# EAGLE design main (EAGLE 7.7.0)

## Sheet 1 of 7
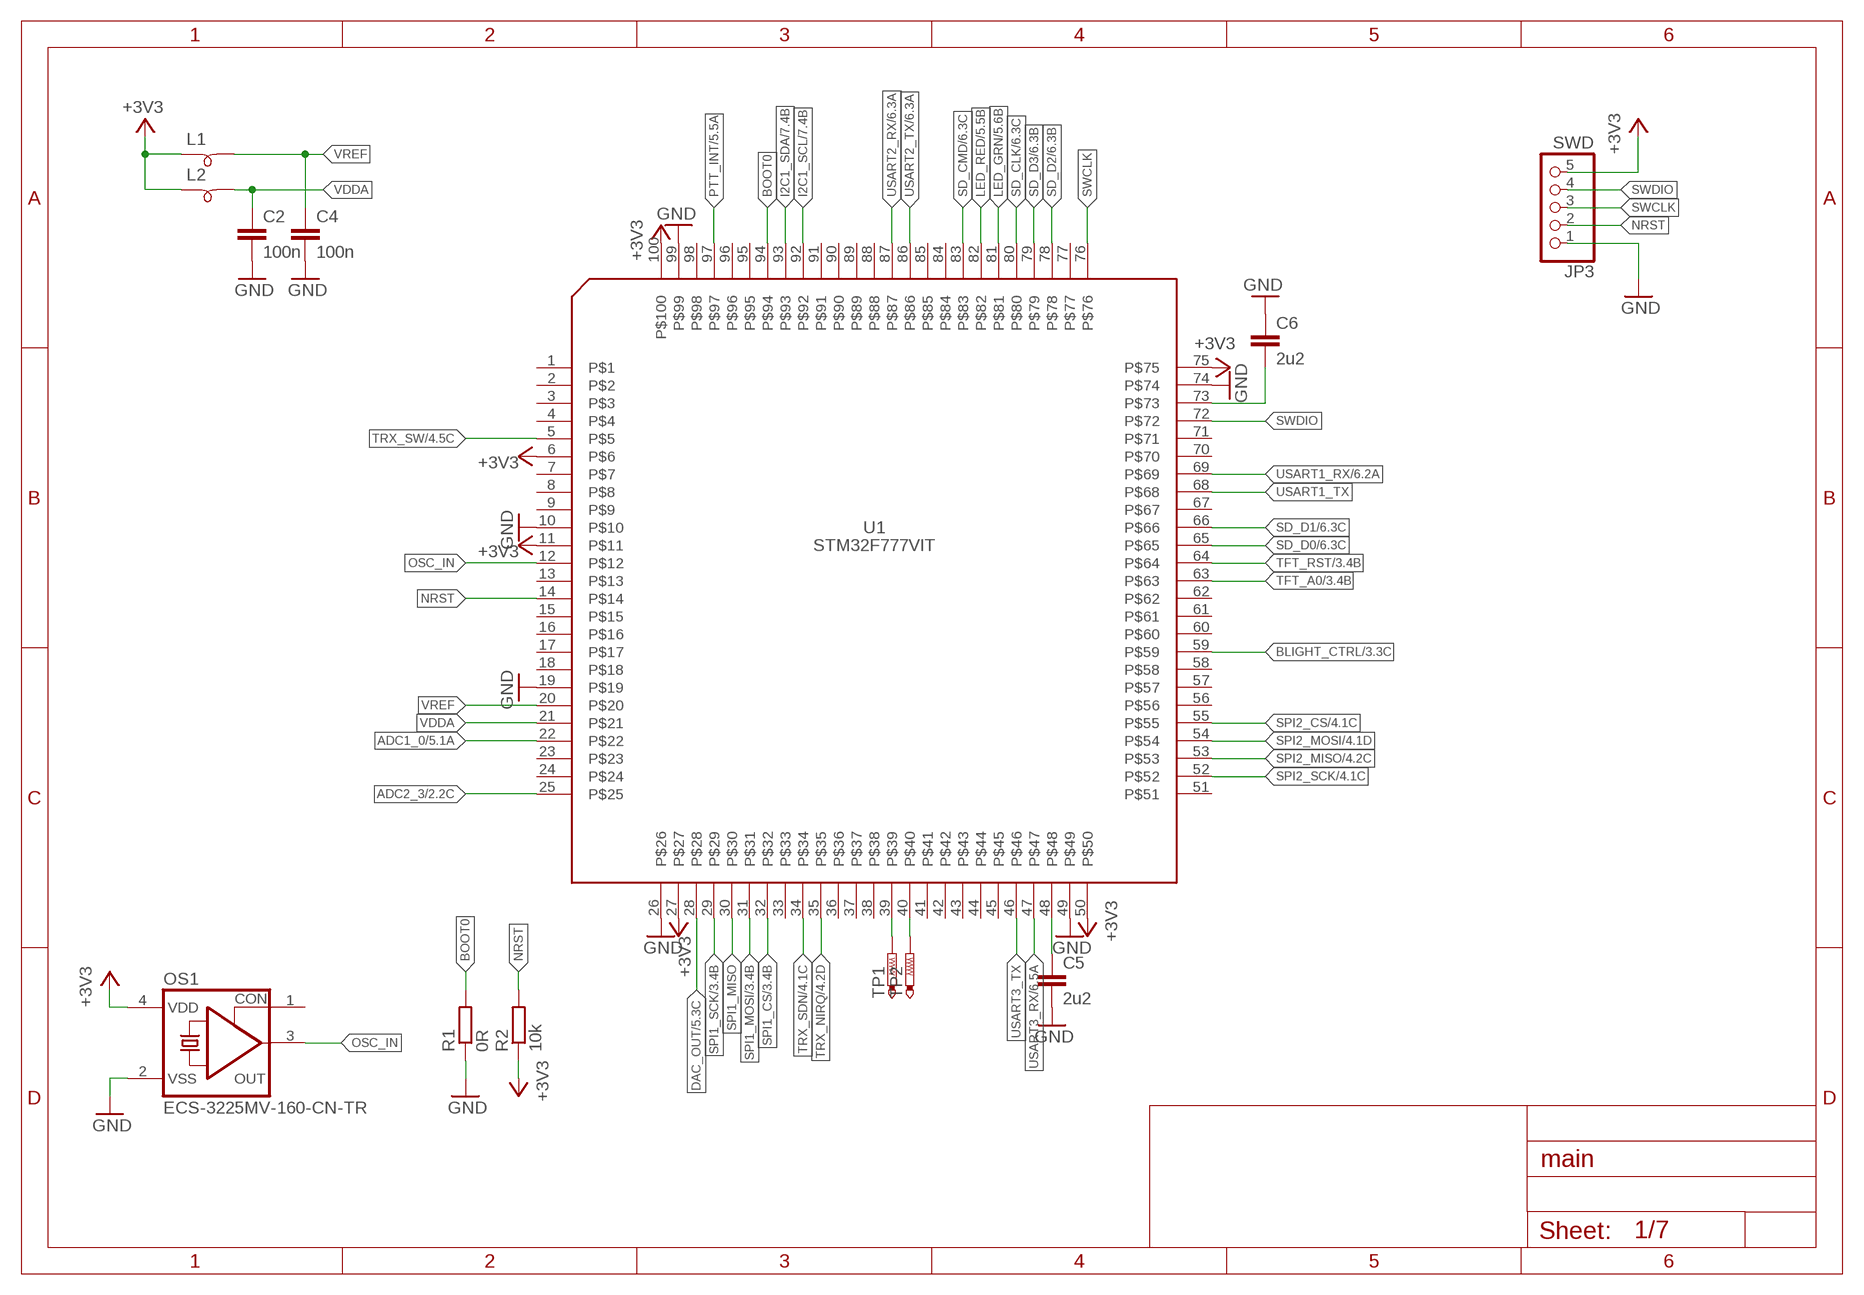
[diagram p0: schematic, sheet 1]

### Parts
C2  100n  C-EUC0805  [C0805]
C4  100n  C-EUC0805  [C0805]
C5  2u2  C-EUC1206  [C1206]
C6  2u2  C-EUC1206  [C1206]
JP3  SWD  PINHD-1X5/90  [1X05/90]
L1  SM-B5  [SM-B5]
L2  SM-B5  [SM-B5]
OS1  ECS-3225MV-160-CN-TR  OSC-OE-CFPS-39  [3.4X2.7-4-PAD]
R1  0R  R-EU_R0805  [R0805]
R2  10k  R-EU_R0805  [R0805]
TP1  PTR1B1,27  [B1,27]
TP2  PTR1B1,27  [B1,27]
U1  STM32F777VIT  [LQFP100]

### Nets
+3V3 [pwr]: JP3.5 L1.1 L2.1 OS1.4(VDD) R2.1 U1.6 U1.11 U1.27 U1.50 U1.75 U1.100 ; also sheet 2,3,4,5,6,7
ADC1_0: U1.22 ; also sheet 5
ADC2_3: U1.25 ; also sheet 2
BLIGHT_CTRL: U1.59 ; also sheet 3
BOOT0: R1.2 U1.94
DAC_OUT: U1.28 ; also sheet 5
GND [pwr]: C2.2 C4.2 C5.2 C6.1 JP3.1 OS1.2(VSS) R1.1 U1.10 U1.19 U1.26 U1.49 U1.74 U1.99 ; also sheet 2,3,4,5,6,7
I2C1_SCL: U1.92 ; also sheet 7
I2C1_SDA: U1.93 ; also sheet 7
LED_GRN: U1.81 ; also sheet 5
LED_RED: U1.82 ; also sheet 5
N$1: C6.2 U1.73
N$6: C5.1 U1.48
N$19: TP1.TP U1.39
N$20: TP2.TP U1.40
NRST: JP3.2 R2.2 U1.14
OSC_IN: OS1.3(OUT) U1.12
PTT_INT: U1.97 ; also sheet 5
SD_CLK: U1.80 ; also sheet 6
SD_CMD: U1.83 ; also sheet 6
SD_D0: U1.65 ; also sheet 6
SD_D1: U1.66 ; also sheet 6
SD_D2: U1.78 ; also sheet 6
SD_D3: U1.79 ; also sheet 6
SPI1_CS: U1.32 ; also sheet 3
SPI1_MISO: U1.30
SPI1_MOSI: U1.31 ; also sheet 3
SPI1_SCK: U1.29 ; also sheet 3
SPI2_CS: U1.55 ; also sheet 4
SPI2_MISO: U1.53 ; also sheet 4
SPI2_MOSI: U1.54 ; also sheet 4
SPI2_SCK: U1.52 ; also sheet 4
SWCLK: JP3.3 U1.76
SWDIO: JP3.4 U1.72
TFT_A0: U1.63 ; also sheet 3
TFT_RST: U1.64 ; also sheet 3
TRX_NIRQ: U1.35 ; also sheet 4
TRX_SDN: U1.34 ; also sheet 4
TRX_SW: U1.5 ; also sheet 4
USART1_RX: U1.69 ; also sheet 6
USART1_TX: U1.68
USART2_RX: U1.87 ; also sheet 6
USART2_TX: U1.86 ; also sheet 6
USART3_RX: U1.47 ; also sheet 6
USART3_TX: U1.46
VDDA: C2.1 L2.2 U1.21
VREF: C4.1 L1.2 U1.20
Unconnected: OS1.1(CON) U1.1 U1.2 U1.3 U1.4 U1.7 U1.8 U1.9 U1.13 U1.15 U1.16 U1.17 U1.18 U1.23 U1.24 U1.33 U1.36 U1.37 U1.38 U1.41 U1.42 U1.43 U1.44 U1.45 U1.51 U1.56 U1.57 U1.58 U1.60 U1.61 U1.62 U1.67 U1.70 U1.71 U1.77 U1.84 U1.85 U1.88 U1.89 U1.90 U1.91 U1.95 U1.96 U1.98

## Sheet 2 of 7
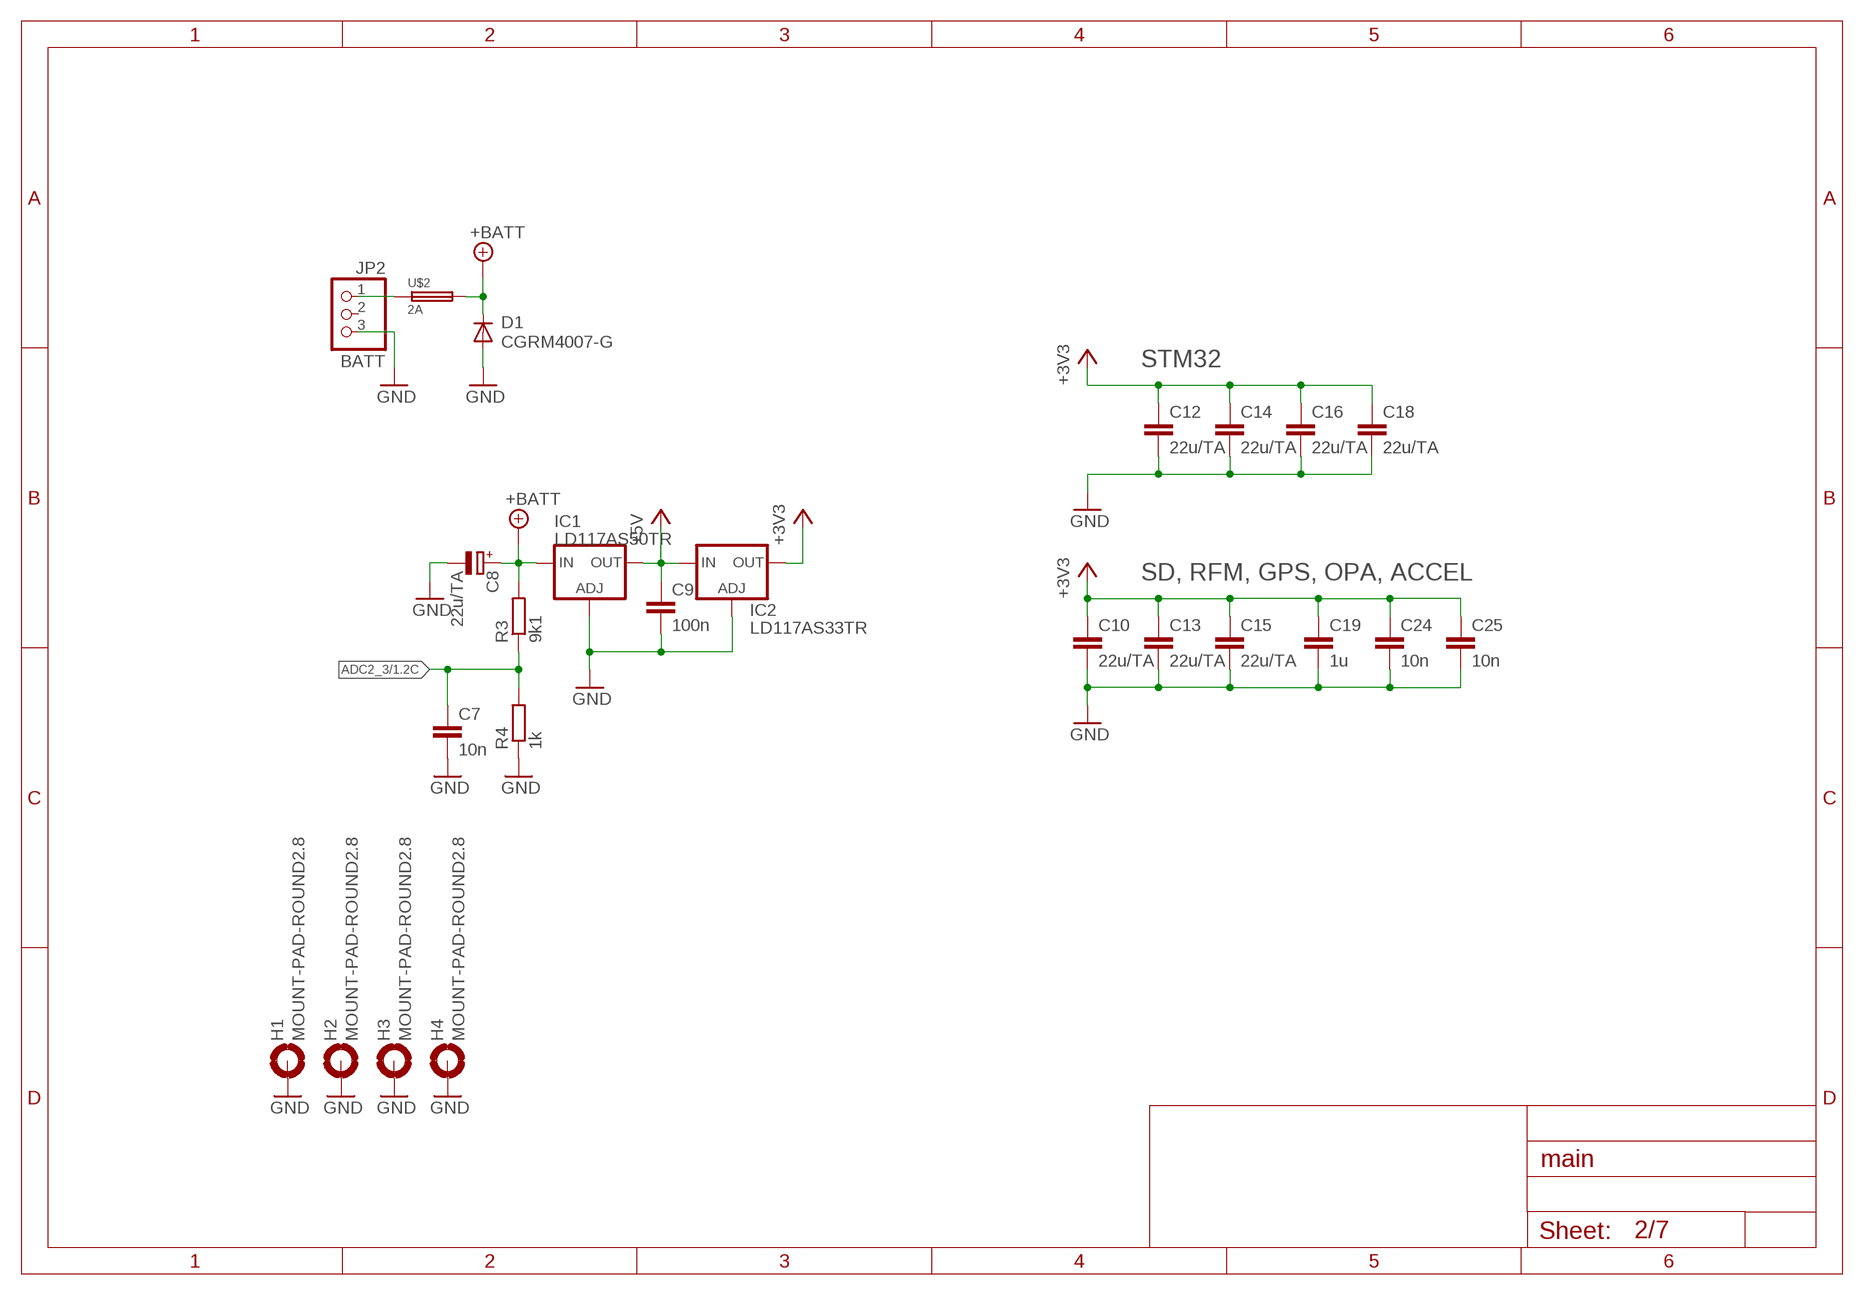
[diagram p1: schematic, sheet 2]

### Parts
C7  10n  C-EUC0805  [C0805]
C8  22u/TA  CPOL-EUSMCC  [SMC_C]
C9  100n  C-EUC1206  [C1206]
C10  22u/TA  C-EUC1206  [C1206]
C12  22u/TA  C-EUC1206  [C1206]
C13  22u/TA  C-EUC1206  [C1206]
C14  22u/TA  C-EUC1206  [C1206]
C15  22u/TA  C-EUC1206  [C1206]
C16  22u/TA  C-EUC1206  [C1206]
C18  22u/TA  C-EUC1206  [C1206]
C19  1u  C-EUC1206  [C1206]
C24  10n  C-EUC0805  [C0805]
C25  10n  C-EUC0805  [C0805]
D1  CGRM4007-G  [SOD-123_MINI-SMA]
H1  MOUNT-PAD-ROUND2.8  [2,8-PAD]
H2  MOUNT-PAD-ROUND2.8  [2,8-PAD]
H3  MOUNT-PAD-ROUND2.8  [2,8-PAD]
H4  MOUNT-PAD-ROUND2.8  [2,8-PAD]
IC1  LD117AS50TR  [SOT223]
IC2  LD117AS33TR  [SOT223]
JP2  BATT  PINHD-1X3/90  [1X03/90]
R3  9k1  R-EU_R0805  [R0805]
R4  1k  R-EU_R0805  [R0805]
U$2  2A  SMD-FUSE  [1206]

### Nets
+3V3 [pwr]: C10.1 C12.1 C13.1 C14.1 C15.1 C16.1 C18.1 C19.1 C24.1 C25.1 IC2.4(OUT) ; also sheet 1,3,4,5,6,7
+5V [pwr]: C9.1 IC1.4(OUT) IC2.3(IN)
+BATT [pwr]: C8.+ D1.C IC1.3(IN) R3.2 U$2.2 ; also sheet 4,5
ADC2_3: C7.1 R3.1 R4.2 ; also sheet 1
GND [pwr]: C7.2 C8.- C9.2 C10.2 C12.2 C13.2 C14.2 C15.2 C16.2 C18.2 C19.2 C24.2 C25.2 D1.A H1.B2,8(MOUNT) H2.B2,8(MOUNT) H3.B2,8(MOUNT) H4.B2,8(MOUNT) IC1.1(ADJ) IC2.1(ADJ) JP2.3 R4.1 ; also sheet 1,3,4,5,6,7
N$8 [pwr]: JP2.1 U$2.1
Unconnected: JP2.2

### Notes on the sheet
- STM32
- SD, RFM, GPS, OPA, ACCEL

## Sheet 3 of 7
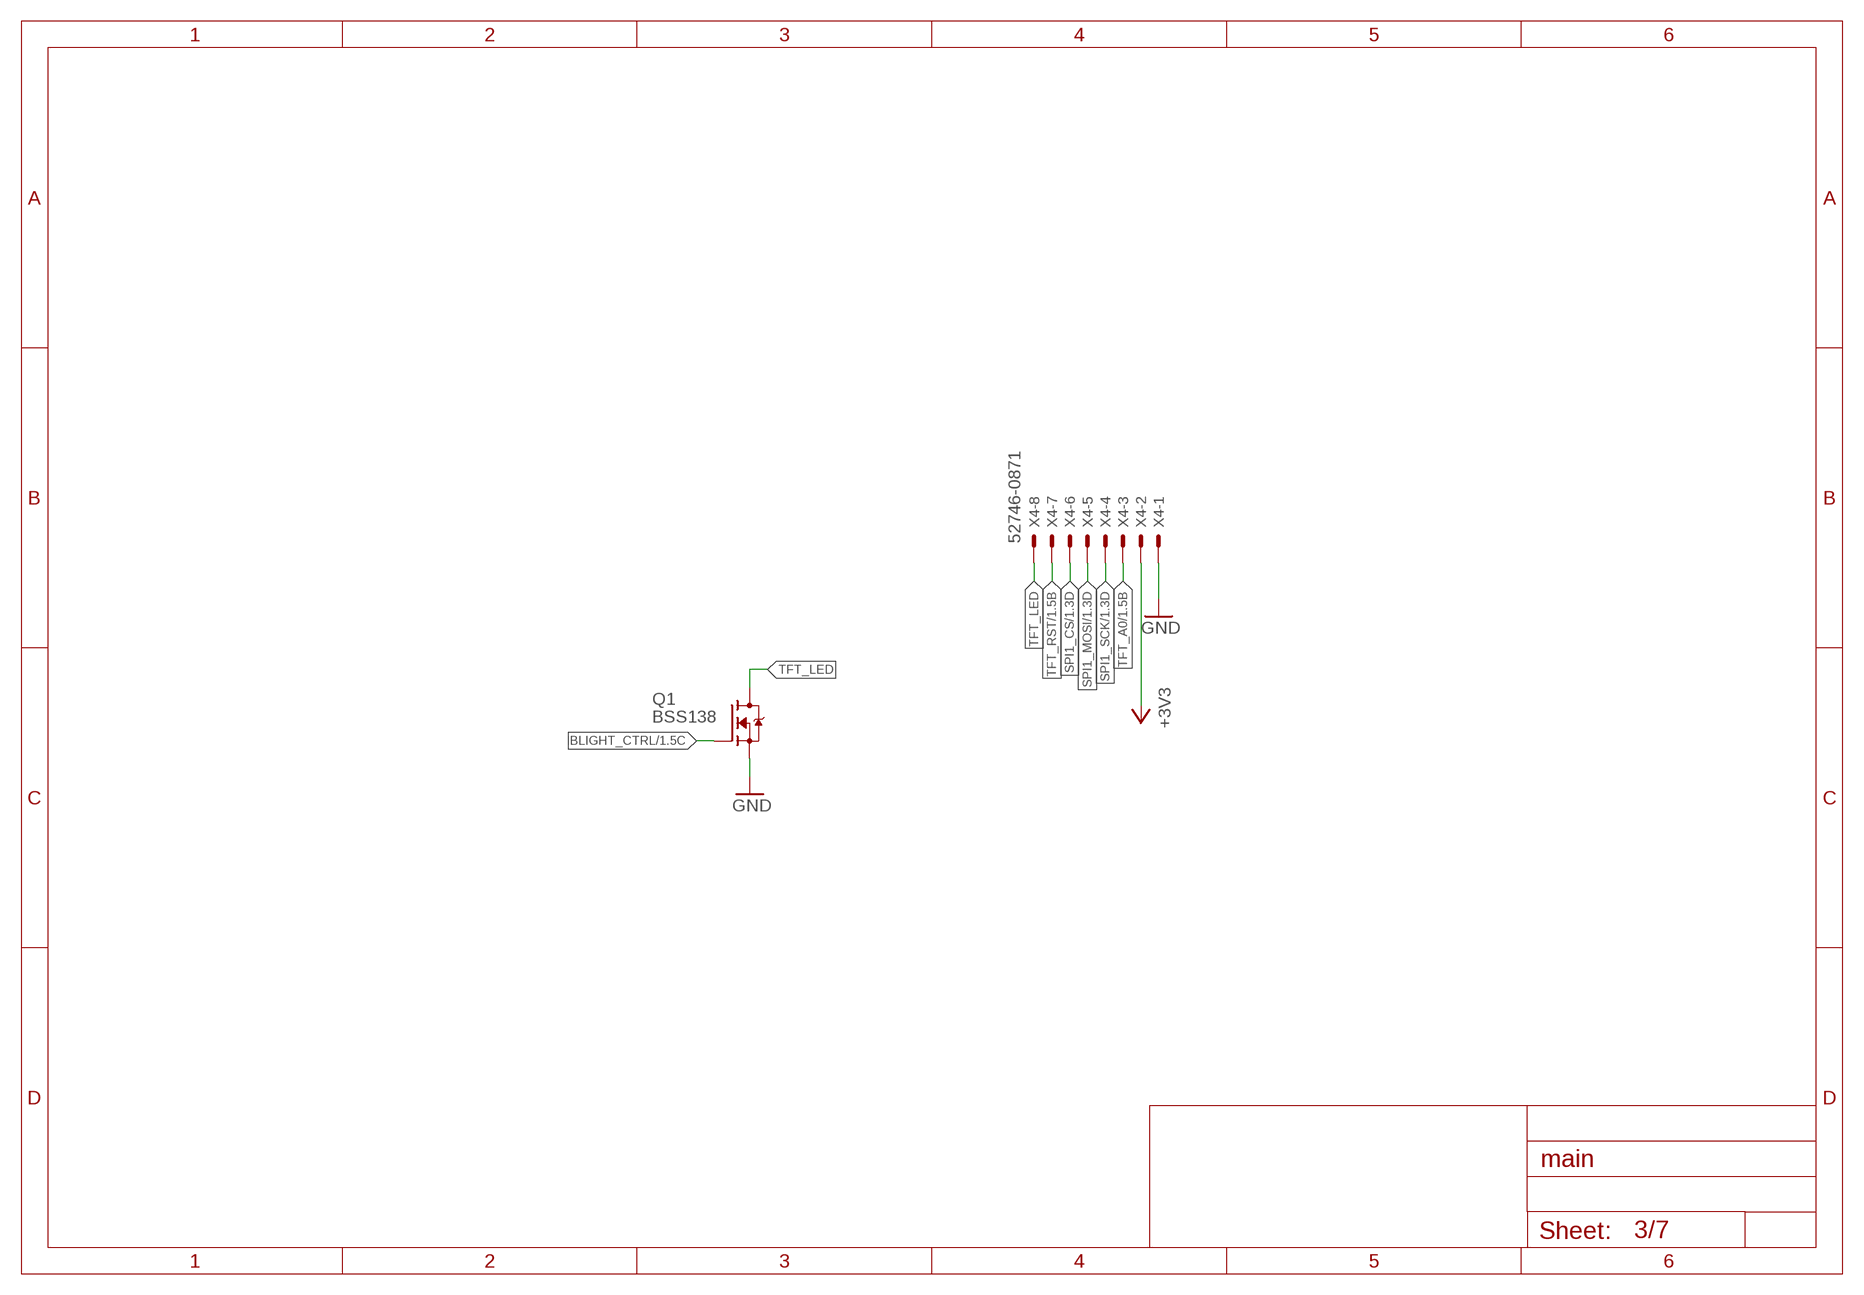
[diagram p2: schematic, sheet 3]

### Parts
Q1  BSS138  [SOT23]
X4  52746-0871  52745-0890  [52745-0890]

### Nets
+3V3 [pwr]: X4.2 ; also sheet 1,2,4,5,6,7
BLIGHT_CTRL: Q1.1(G) ; also sheet 1
GND [pwr]: Q1.2(S) X4.1 ; also sheet 1,2,4,5,6,7
SPI1_CS: X4.6 ; also sheet 1
SPI1_MOSI: X4.5 ; also sheet 1
SPI1_SCK: X4.4 ; also sheet 1
TFT_A0: X4.3 ; also sheet 1
TFT_LED [pwr]: Q1.3(D) X4.8
TFT_RST: X4.7 ; also sheet 1

## Sheet 4 of 7
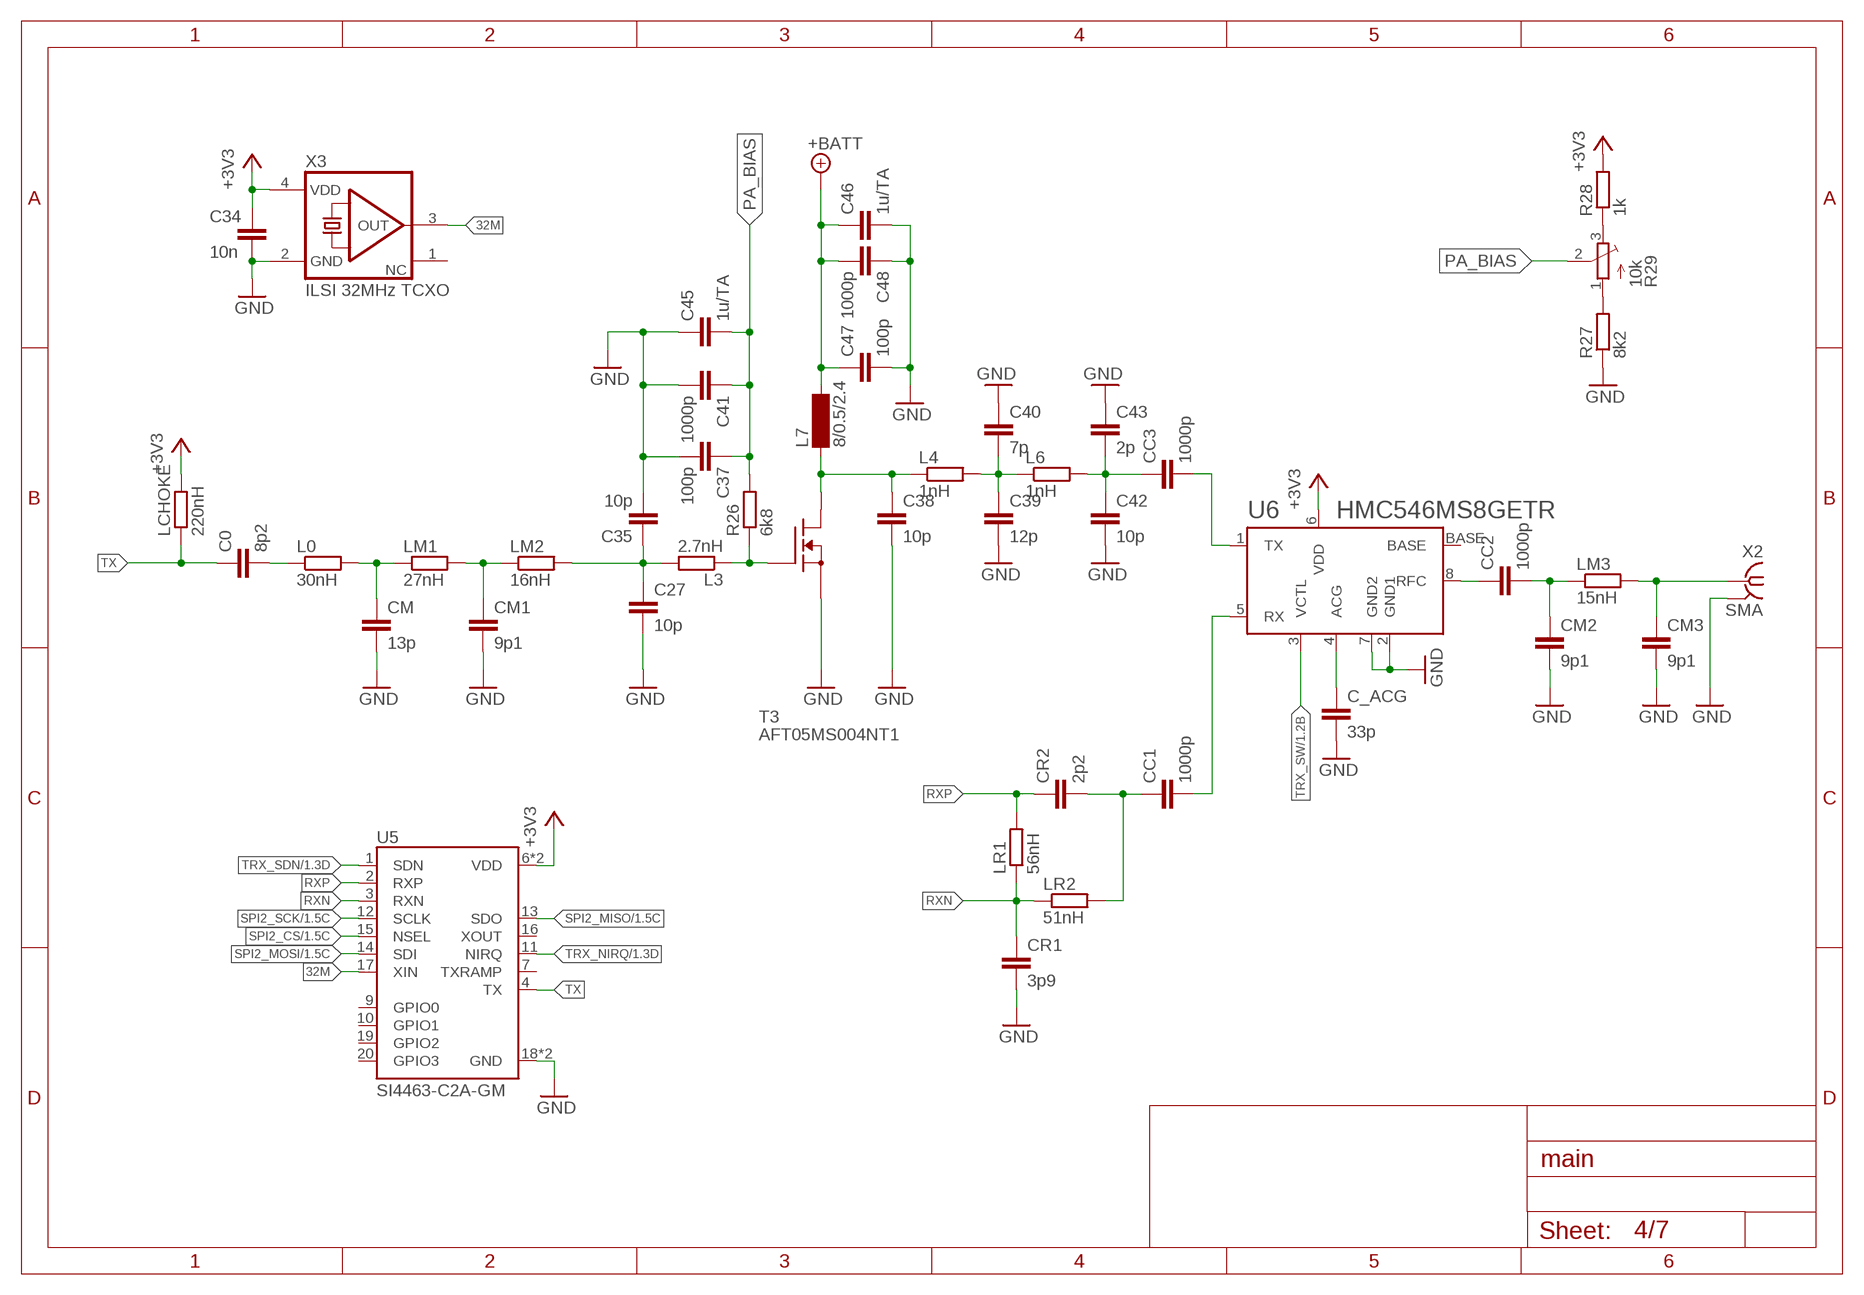
[diagram p3: schematic, sheet 4]

### Parts
C0  8p2  C-EUC0805  [C0805]
C27  10p  C-EUC0805  [C0805]
C34  10n  C-EUC0805  [C0805]
C35  10p  C-EUC0805  [C0805]
C37  100p  C-EUC0805  [C0805]
C38  10p  C-EUC0805  [C0805]
C39  12p  C-EUC0805  [C0805]
C40  7p  C-EUC0805  [C0805]
C41  1000p  C-EUC0805  [C0805]
C42  10p  C-EUC0805  [C0805]
C43  2p  C-EUC0805  [C0805]
C45  1u/TA  C-EUC1206  [C1206]
C46  1u/TA  C-EUC1206  [C1206]
C47  100p  C-EUC0805  [C0805]
C48  1000p  C-EUC0805  [C0805]
C_ACG  33p  C-EUC0805  [C0805]
CC1  1000p  C-EUC0805  [C0805]
CC2  1000p  C-EUC0805  [C0805]
CC3  1000p  C-EUC0805  [C0805]
CM  13p  C-EUC0805  [C0805]
CM1  9p1  C-EUC0805  [C0805]
CM2  9p1  C-EUC0805  [C0805]
CM3  9p1  C-EUC0805  [C0805]
CR1  3p9  C-EUC0805  [C0805]
CR2  2p2  C-EUC0805  [C0805]
L0  30nH  R-EU_R0805  [R0805]
L3  2.7nH  R-EU_R0805  [R0805]
L4  1nH  R-EU_R0603  [R0603]
L6  1nH  R-EU_R0603  [R0603]
L7  8/0.5/2.4  AIR_COIL  [SM-L15B]
LCHOKE  220nH  R-EU_R0805  [R0805]
LM1  27nH  R-EU_R0805  [R0805]
LM2  16nH  R-EU_R0805  [R0805]
LM3  15nH  R-EU_R0805  [R0805]
LR1  56nH  R-EU_R0805  [R0805]
LR2  51nH  R-EU_R0805  [R0805]
R26  6k8  R-EU_R0805  [R0805]
R27  8k2  R-EU_R0805  [R0805]
R28  1k  R-EU_R0805  [R0805]
R29  10k  TRIM_EU-3223W  [3223W]
T3  AFT05MS004NT1  [SOT89-BCE]
U5  SI4463-C2A-GM  [QFN50P400X400X90-20N]
U6  HMC546MS8GETR  [SOP65P490X110-8N]
X2  SMA  SMA-142-0701-871/876  [J502-ND-142-0701-871/876]
X3  ILSI 32MHz TCXO  ASE  [ASE]

### Nets
32M: U5.17(XIN) X3.3(OUT)
+3V3 [pwr]: C34.1 LCHOKE.2 R28.2 U5.6(VDD) U5.8(VDD) U6.6(VDD) X3.4(VDD) ; also sheet 1,2,3,5,6,7
+BATT [pwr]: C46.1 C47.1 C48.2 L7.2 ; also sheet 2,5
GND [pwr]: C27.2 C34.2 C35.2 C37.2 C38.2 C39.2 C40.1 C41.2 C42.2 C43.1 C45.1 C46.2 C47.2 C48.1 C_ACG.2 CM1.2 CM2.2 CM3.2 CM.2 CR1.2 R27.1 T3.S U5.18(GND) U5.21(GND) U6.2(GND1) U6.7(GND2) X2.G@1 X2.G@2 X2.G@3 X2.G@4 X3.2(GND) ; also sheet 1,2,3,5,6,7
N$9: CC3.2 U6.1(TX)
N$15: C27.1 C35.1 L3.2 LM2.2
N$21 [rf]: CM3.1 LM3.2 X2.1
N$22 [rf]: CC2.2 CM2.1 LM3.1
N$23 [rf]: C0.2 L0.1
N$24 [rf]: CM.1 L0.2 LM1.1
N$25 [rf]: CM1.1 LM1.2 LM2.1
N$28: R27.2 R29.1(A)
N$29: CC1.1 CR2.2 LR2.2
N$30: L3.1 R26.1 T3.G
N$31: CC1.2 U6.5(RX)
N$32 [rf]: CC2.1 U6.8(RFC)
N$33: C_ACG.1 U6.4(ACG)
N$34: R28.1 R29.3(E)
N$35: C38.1 L4.1 L7.1 T3.D
N$36: C39.1 C40.2 L4.2 L6.1
N$37: C42.1 C43.2 CC3.1 L6.2
PA_BIAS: C37.1 C41.1 C45.2 R26.2 R29.2(S)
RXN: CR1.1 LR1.1 LR2.1 U5.3(RXN)
RXP: CR2.1 LR1.2 U5.2(RXP)
SPI2_CS: U5.15(NSEL) ; also sheet 1
SPI2_MISO: U5.13(SDO) ; also sheet 1
SPI2_MOSI: U5.14(SDI) ; also sheet 1
SPI2_SCK: U5.12(SCLK) ; also sheet 1
TRX_NIRQ: U5.11(NIRQ) ; also sheet 1
TRX_SDN: U5.1(SDN) ; also sheet 1
TRX_SW: U6.3(VCTL) ; also sheet 1
TX [rf]: C0.1 LCHOKE.1 U5.4(TX)
Unconnected: U5.7(TXRAMP) U5.9(GPIO0) U5.10(GPIO1) U5.16(XOUT) U5.19(GPIO2) U5.20(GPIO3) U6.BASE X3.1(NC)

## Sheet 5 of 7
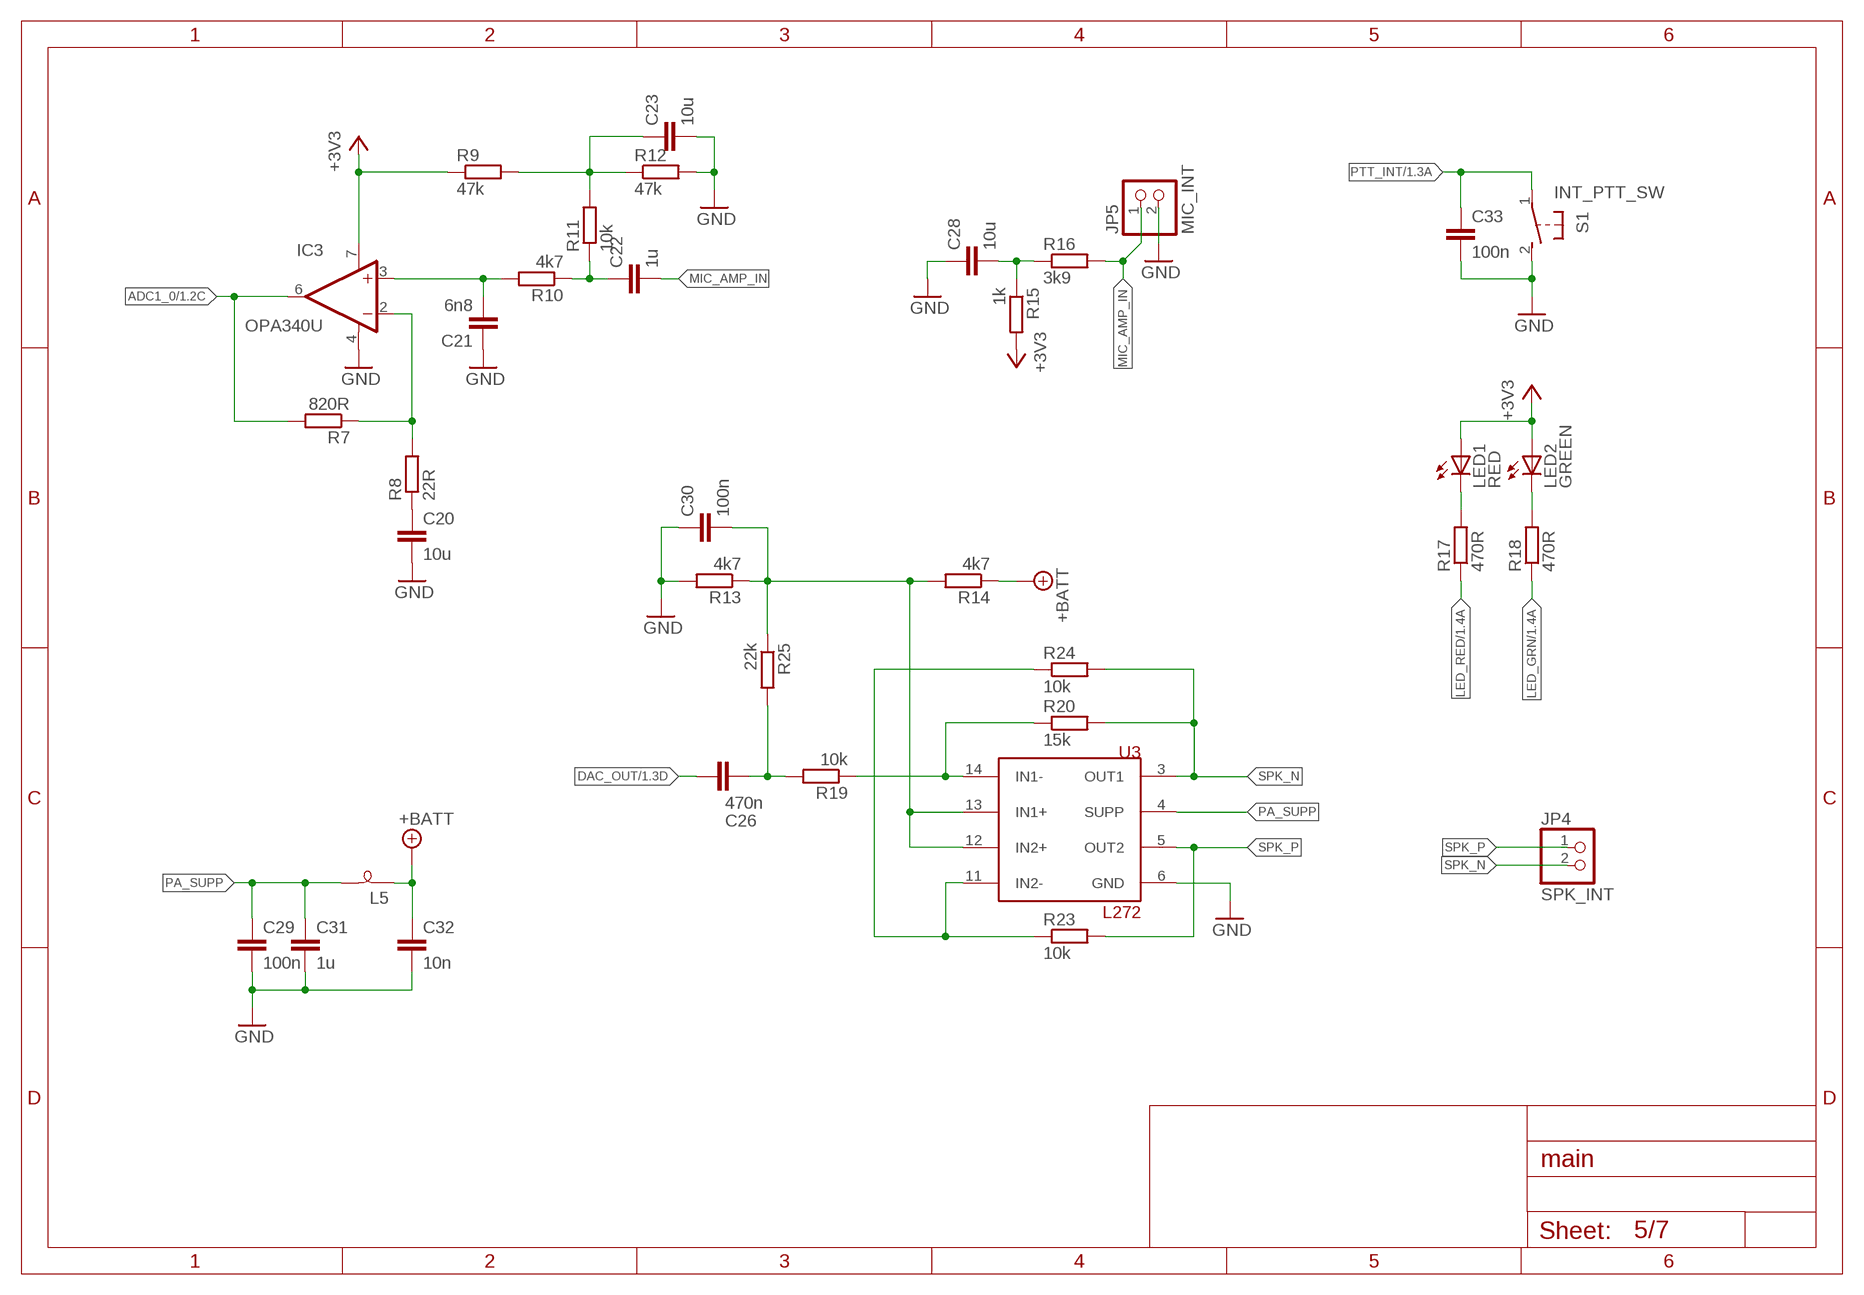
[diagram p4: schematic, sheet 5]

### Parts
C20  10u  C-EUC1206  [C1206]
C21  6n8  C-EUC0805  [C0805]
C22  1u  C-EUC1206  [C1206]
C23  10u  C-EUC1206  [C1206]
C26  470n  C-EUC0805  [C0805]
C28  10u  C-EUC1206  [C1206]
C29  100n  C-EUC1206  [C1206]
C30  100n  C-EUC1206  [C1206]
C31  1u  C-EUC1206  [C1206]
C32  10n  C-EUC0805  [C0805]
C33  100n  C-EUC0805  [C0805]
IC3  OPA340U  [SO08]
JP4  SPK_INT  PINHD-1X2  [1X02]
JP5  MIC_INT  PINHD-1X2  [1X02]
L5  SM-B5  [SM-B5]
LED1  RED  LEDCHIPLED_1206  [CHIPLED_1206]
LED2  GREEN  LEDCHIPLED_1206  [CHIPLED_1206]
R7  820R  R-EU_R0805  [R0805]
R8  22R  R-EU_R0805  [R0805]
R9  47k  R-EU_R0805  [R0805]
R10  4k7  R-EU_R0805  [R0805]
R11  10k  R-EU_R0805  [R0805]
R12  47k  R-EU_R0805  [R0805]
R13  4k7  R-EU_R0805  [R0805]
R14  4k7  R-EU_R0805  [R0805]
R15  1k  R-EU_R0805  [R0805]
R16  3k9  R-EU_R0805  [R0805]
R17  470R  R-EU_R0805  [R0805]
R18  470R  R-EU_R0805  [R0805]
R19  10k  R-EU_R0805  [R0805]
R20  15k  R-EU_R0805  [R0805]
R23  10k  R-EU_R0805  [R0805]
R24  10k  R-EU_R0805  [R0805]
R25  22k  R-EU_R0805  [R0805]
S1  INT_PTT_SW  31-XX  [B3F-31XX]
U3  L272  [SO16]

### Nets
+3V3 [pwr]: IC3.7(V+) LED1.A LED2.A R9.1 R15.2 ; also sheet 1,2,3,4,6,7
+BATT [pwr]: C32.1 L5.1 R14.1 ; also sheet 2,4
ADC1_0: IC3.6(OUT) R7.2 ; also sheet 1
DAC_OUT: C26.1 ; also sheet 1
GND [pwr]: C20.2 C21.1 C23.2 C28.1 C29.2 C30.1 C31.2 C32.2 C33.2 IC3.4(V-) JP5.2 R12.2 R13.2 S1.2(S) U3.6(GND) ; also sheet 1,2,3,4,6,7
LED_GRN: R18.1 ; also sheet 1
LED_RED: R17.1 ; also sheet 1
MIC_AMP_IN: C22.2 JP5.1 R16.2
N$3: R19.1 R20.1 U3.14(IN1-)
N$4: IC3.2(-IN) R7.1 R8.2
N$5: C22.1 R10.1 R11.1
N$10: C20.1 R8.1
N$11: LED1.C R17.2
N$12: LED2.C R18.2
N$13: R23.1 R24.1 U3.11(IN2-)
N$14: C26.2 R19.2 R25.2
N$16: C28.2 R15.1 R16.1
N$17: C21.2 IC3.3(+IN) R10.2
N$18: C23.1 R9.2 R11.2 R12.1
N$27: C30.2 R13.1 R14.2 R25.1 U3.12(IN2+) U3.13(IN1+)
PA_SUPP [pwr]: C29.1 C31.1 L5.2 U3.4(SUPP)
PTT_INT: C33.1 S1.1(P) ; also sheet 1
SPK_N [pwr]: JP4.2 R20.2 R24.2 U3.3(OUT1)
SPK_P [pwr]: JP4.1 R23.2 U3.5(OUT2)

## Sheet 6 of 7
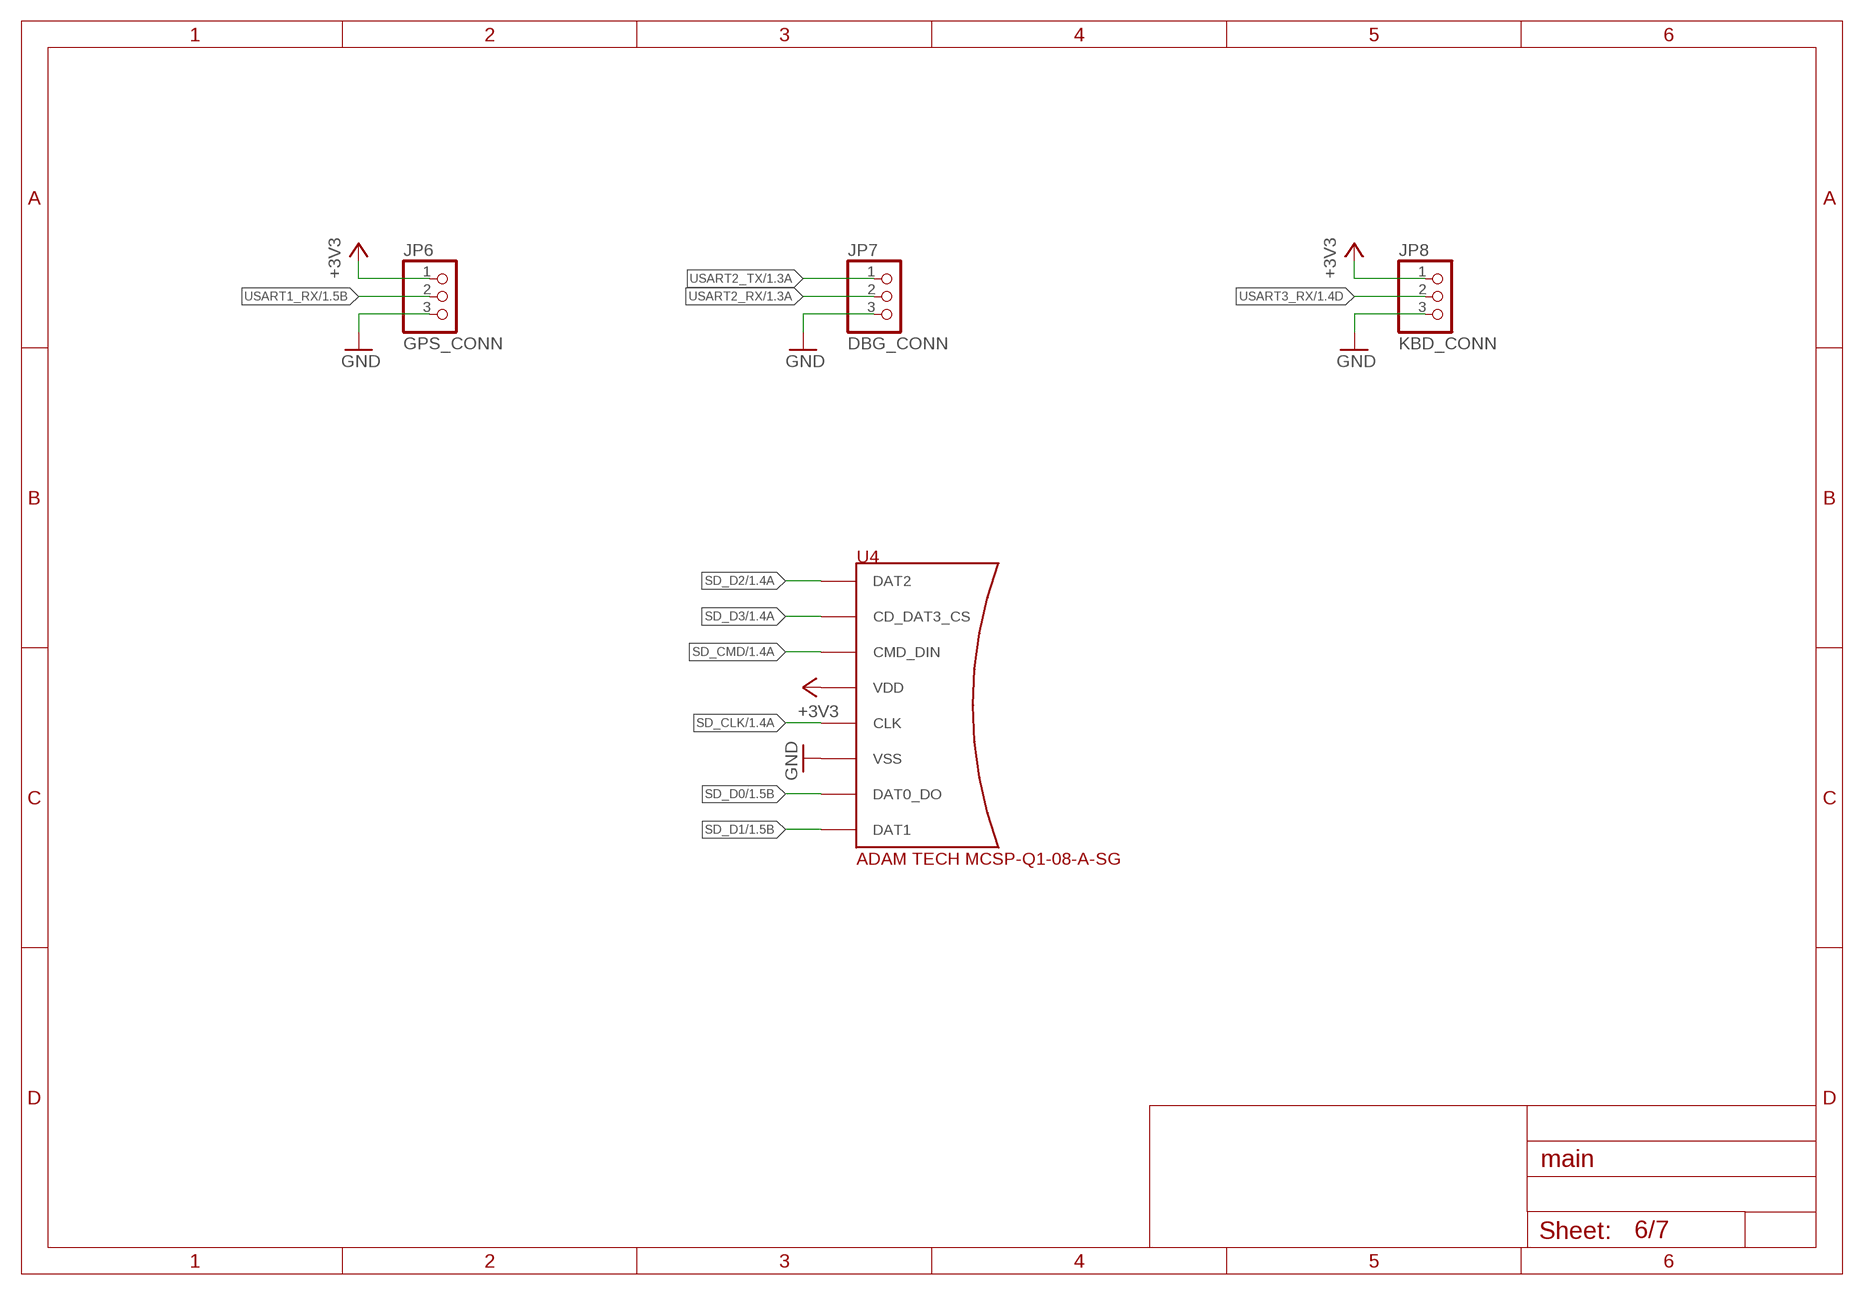
[diagram p5: schematic, sheet 6]

### Parts
JP6  GPS_CONN  PINHD-1X3  [1X03]
JP7  DBG_CONN  PINHD-1X3  [1X03]
JP8  KBD_CONN  PINHD-1X3  [1X03]
U4  ADAM TECH MCSP-Q1-08-A-SG  MICROSD-PUSH-OUT  [MICROSD-PUSH-OUT]

### Nets
+3V3 [pwr]: JP6.1 JP8.1 U4.4(VDD) ; also sheet 1,2,3,4,5,7
GND [pwr]: JP6.3 JP7.3 JP8.3 U4.6(VSS) U4.G1(VSS) U4.G2(VSS) U4.G3(VSS) U4.G4(VSS) ; also sheet 1,2,3,4,5,7
SD_CLK: U4.5(CLK) ; also sheet 1
SD_CMD: U4.3(CMD_DIN) ; also sheet 1
SD_D0: U4.7(DAT0_DO) ; also sheet 1
SD_D1: U4.8(DAT1) ; also sheet 1
SD_D2: U4.1(DAT2) ; also sheet 1
SD_D3: U4.2(CD_DAT3_CS) ; also sheet 1
USART1_RX: JP6.2 ; also sheet 1
USART2_RX: JP7.2 ; also sheet 1
USART2_TX: JP7.1 ; also sheet 1
USART3_RX: JP8.2 ; also sheet 1

## Sheet 7 of 7
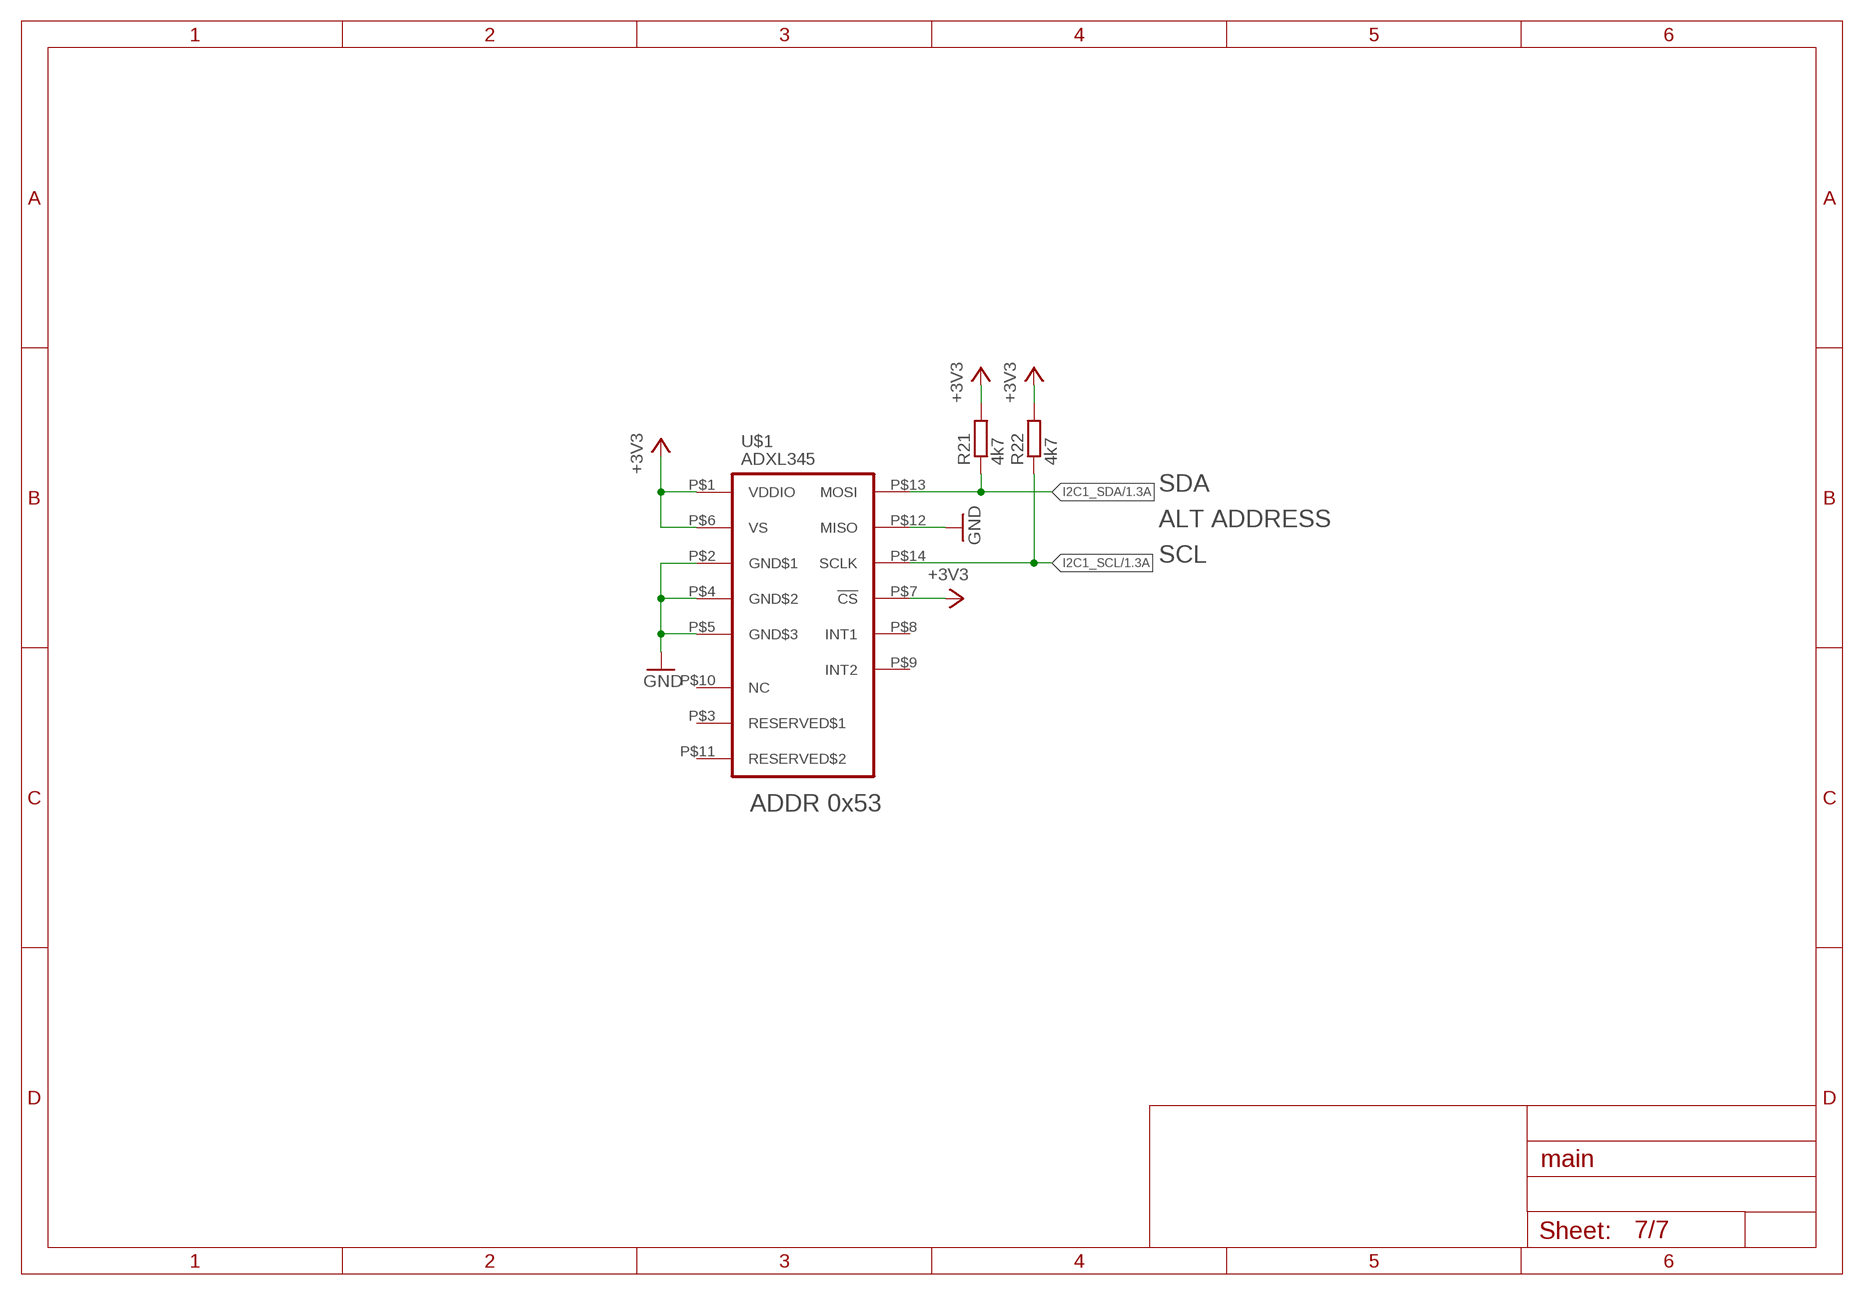
[diagram p6: schematic, sheet 7]

### Parts
R21  4k7  R-EU_R0805  [R0805]
R22  4k7  R-EU_R0805  [R0805]
U$1  ADXL345  [LGA14]

### Nets
+3V3 [pwr]: R21.2 R22.2 U$1.P$1(VDDIO) U$1.P$6(VS) U$1.P$7(!CS) ; also sheet 1,2,3,4,5,6
GND [pwr]: U$1.P$2(GND$1) U$1.P$4(GND$2) U$1.P$5(GND$3) U$1.P$12(MISO) ; also sheet 1,2,3,4,5,6
I2C1_SCL: R22.1 U$1.P$14(SCLK) ; also sheet 1
I2C1_SDA: R21.1 U$1.P$13(MOSI) ; also sheet 1
Unconnected: U$1.P$3(RESERVED$1) U$1.P$8(INT1) U$1.P$9(INT2) U$1.P$10(NC) U$1.P$11(RESERVED$2)

### Notes on the sheet
- SDA
- ALT ADDRESS
- SCL
- ADDR 0x53

## Library data of the parts
C0 C2 C4-C6 C19-C23 C26-C35 C37-C43 C47 C48 C_ACG CC1-CC3 CM CM1-CM3 CR1 CR2 = rcl:C-EU: CAPACITOR, European symbol
C7 C9 C10 C12-C16 C18 C24 C25 C45 C46 = resistor:C-EU: CAPACITOR, European symbol
C8 = resistor:CPOL-EU: POLARIZED CAPACITOR, European symbol
D1 = diode:CGRM400*-G: Molded plasitc,JEDEC SOD-123/Mini SMA Source: Comchip CGRM4001-G.pdf
H1-H4 = holes:MOUNT-PAD-ROUND: MOUNTING PAD, round
IC1 IC2 = v-reg:LD117A?*: Low drop fixed and adjustable positive voltage regulators 1 A Source: http://www.st.com/stonline/products/literature/ds/7194/ld1117axx.pdf
IC3 = burr-brown:OPA340: Rail-to-Rail Operational Amplifiers Single-Supply, MicroAmplifier(TM) Series; MPN: OPA340UA; OC_FARNELL: 1106196; OC_NEWARK: 24M5449
JP2 JP6-JP8 = pinhead:PINHD-1X3: PIN HEADER
JP3 = pinhead:PINHD-1X5: PIN HEADER
JP4 JP5 = pinhead:PINHD-1X2: PIN HEADER
L0 L4 L6 LCHOKE LM1-LM3 LR1 LR2 R1 R2 R7-R20 R23-R25 = resistor:R-EU_: RESISTOR, European symbol
L1 L2 L5 = inductor-neosid:SM-B: INDUCTOR SMD Bead inductor; OC_FARNELL: unknown; OC_NEWARK: unknown
L3 R3 R4 R21 R22 R26-R28 = rcl:R-EU_: RESISTOR, European symbol
L7 = aircoils:AIR_COIL
LED1 LED2 = led:LED: LED OSRAM: - CHIPLED LG R971, LG N971, LY N971, LG Q971, LY Q971, LO R971, LY R971 LH N974, LH R974 LS Q976, LO Q976, LY Q976 LO Q996 - Hyper CHIPLED LW Q18S LB Q993, LB Q99A, LB R99A - SideLED LS A670, LO A670, LY A670, LG A670, LP A670 LB A673, LV A673, LT A673, LW A673 LH A674 LY A675 LS A676, LA A676, LO A676, LY A676, LW A676 LS A679, LY A679, LG A679 - Hyper Micro SIDELED® LS Y876, LA Y876, LO Y876, LY Y876 LT Y87S - SmartLED LW L88C, LW L88S LB L89C, LB L89S, LG L890 LS L89K, LO L89K, LY L89K LS L896, LA L896, LO L896, LY L896 - TOPLED LS T670, LO T670, LY T670, LG T670, LP T670 LSG T670, LSP T670, LSY T670, LOP T670, LYG T670 LG T671, LOG T671, LSG T671 LB T673, LV T673, LT T673, LW T673 LH T674 LS T676, LA T676, LO T676, LY T676, LB T676, LH T676, LSB T676, LW T676 LB T67C, LV T67C, LT T67C, LS T67K, LO T67K, LY T67K, LW E67C LS E67B, LA E67B, LO E67B, LY E67B, LB E67C, LV E67C, LT E67C LW T67C LS T679, LY T679, LG T679 LS T770, LO T770, LY T770, LG T770, LP T770 LB T773, LV T773, LT T773, LW T773 LH T774 LS E675, LA E675, LY E675, LS T675 LS T776, LA T776, LO T776, LY T776, LB T776 LHGB T686 LT T68C, LB T68C - Hyper Mini TOPLED® LB M676 - Mini TOPLED Santana® LG M470 LS M47K, LO M47K, LY M47K Source: http://www.osram.convergy.de LUXEON: - LUMILED® LXK2-PW12-R00, LXK2-PW12-S00, LXK2-PW14-U00, LXK2-PW14-V00 LXK2-PM12-R00, LXK2-PM12-S00, LXK2-PM14-U00 LXK2-PE12-Q00, LXK2-PE12-R00, LXK2-PE12-S00, LXK2-PE14-T00, LXK2-PE14-U00 LXK2-PB12-K00, LXK2-PB12-L00, LXK2-PB12-M00, LXK2-PB14-N00, LXK2-PB14-P00, LXK2-PB14-Q00 LXK2-PR12-L00, LXK2-PR12-M00, LXK2-PR14-Q00, LXK2-PR14-R00 LXK2-PD12-Q00, LXK2-PD12-R00, LXK2-PD12-S00 LXK2-PH12-R00, LXK2-PH12-S00 LXK2-PL12-P00, LXK2-PL12-Q00, LXK2-PL12-R00 Source: www.luxeon.com KINGBRIGHT: KA-3528ASYC Source: www.kingbright.com
OS1 = IQD-Frequency-Products:OSC-OE: OSCILLATOR WITH OE
Q1 = bss138_10:BSS138: BSS138 N-Channel Logic Level Enhancement Mode Field Effect Transistor Source: http://www.fairchildsemi.com/datasheets/BS/BSS138.pdf; MF: Fairchild; MPN: BSS138; OC_FARNELL: 9845330; OC_NEWARK: 67R2009
R29 = pot:TRIM_EU-: POTENTIOMETER
S1 = switch-omron:31-XX: OMRON SWITCH; MPN: B3F-3100; OC_FARNELL: 959704; OC_NEWARK: 36M3582
T3 = AFT05MS004NT1:AFT05MS004NT1
TP1 TP2 = testpad:PTR1: TEST PIN
U1 = micro-stm_v3:STM32F777VIT
U3 = L272:L272
U4 = microsd:MICROSD-PUSH-OUT: T-Flash Push-Out Micro SD Card Reader 14.75mm x 14.5mm SMD with external pins
U5 = SI4463-C2A-GM:SI4463-C2A-GM: RF Transceiver FSK/GFSK/GMSK/MSK/OOK 3.3V 20-Pin QFN EP; AVAILABILITY: Unavailable; DESCRIPTION: RF Transceiver FSK/GFSK/GMSK/MSK/OOK 3.3V 20-Pin QFN EP; MF: Silicon Labs; MP: SI4463-C2A-GM; PACKAGE: VFQFN-20 Silicon Labs; PRICE: None
U6 = HMC546:HMC546MS8GETR
U$1 = adxl345:ADXL345: 3-Axis, ±2 g/±4 g/±8 g/±16 g Digital Accelerometer
U$2 = chiptron_cz:SMD-FUSE
X2 = con-coax:SMA-: SMA 50 Ohm End Launch Jack Receptacle - Round Contact Johnson Components Source: www.johnsoncomponents.com .. J502-ND.pdf; MF: JOHNSON COMPONENTS; MPN: 142-0701-871; OC_FARNELL: 1339835; OC_NEWARK: 91B6105
X3 = ILSI_tcxo:ASE: 2.5 mm x 3.2 mm Ceramic Package SMD TCXO ILSI I547-2P3-32.0000MHz; OC_FARNELL: unknown; OC_NEWARK: unknown
X4 = con-molex:52745-0890: FFC/FPC-to-Board 0.50mm (.020") SMT Top Contact Right Angle, ZIF, Style Receptacle 52745 / 52435 Source: http://www.molex.com/product/ffc/52745.html; MPN: 52745-0890; OC_FARNELL: unknown; OC_NEWARK: 92M6377

## Net classes
0 default: width 0.127 mm, drill 0.2 mm, clearance 0.127 mm
1 pwr: width 0.5 mm, drill 0.2 mm, clearance 0.127 mm
2 rf: width 0.5 mm, drill 0.2 mm, clearance 0.127 mm

## Board
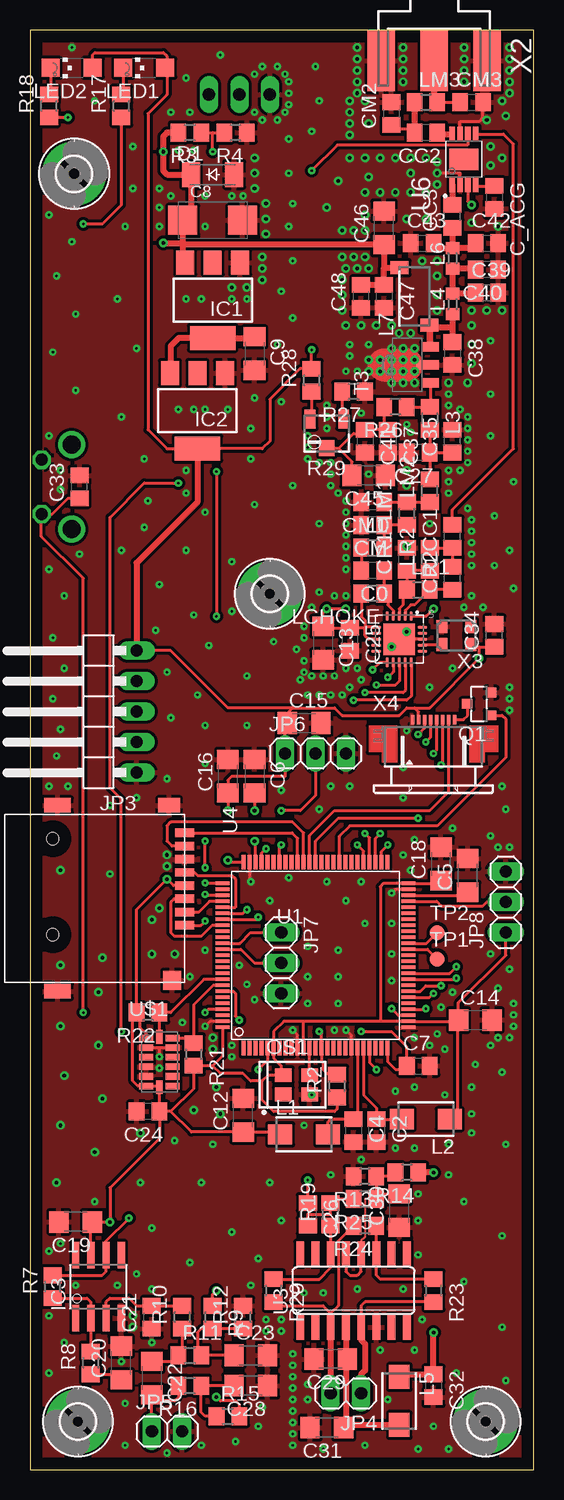
[diagram p7: board, top side]
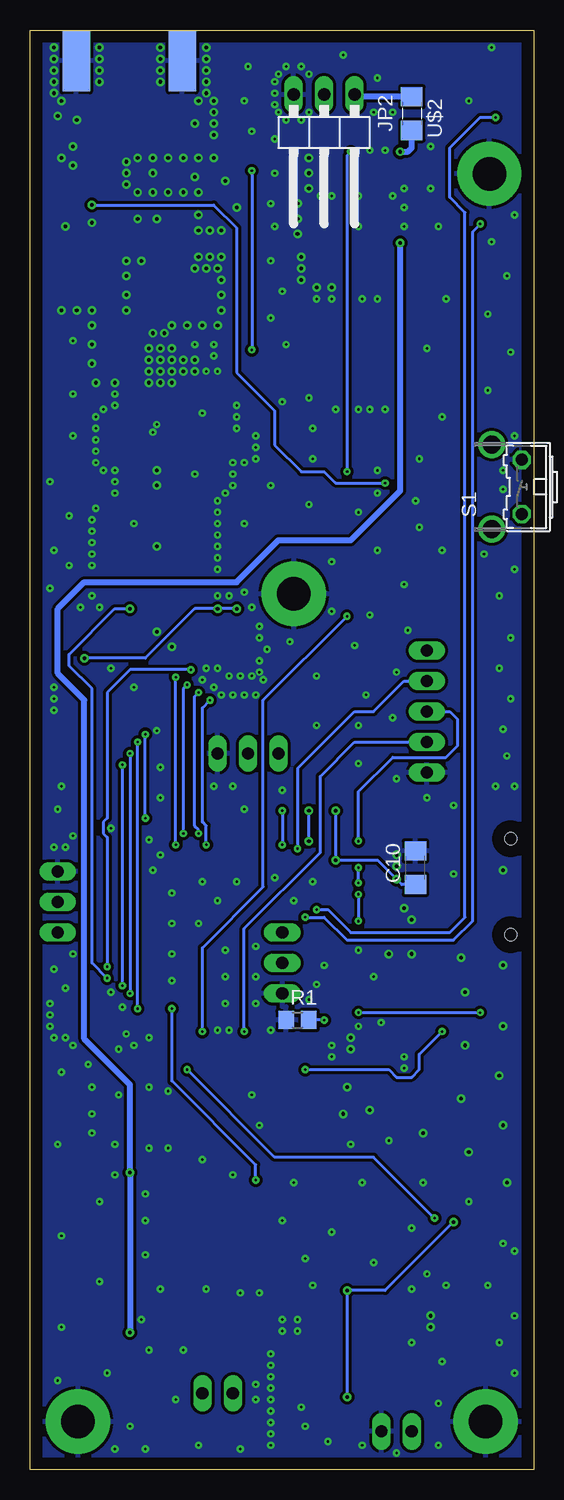
[diagram p8: board, bottom side, seen from below]

Size 42 x 120 mm. Coordinates in mm from the lower left corner, seen from the top.
Outline: 0,0 42,0 42,120 0,120 0,0
Copper layers (1*16): Top 0.035mm / dielectric 1.5mm / Bottom 0.035mm
Design rules "Moje Technoservice 2 *": minimum track width 5mil, minimum drill 0.2mm, track to track 5mil, track to pad 10mil, pad to pad 15mil, via to via 15mil, smd to smd 8mil, copper to edge 40mil, drill to drill 12mil, minimum pad ring 8mil, minimum via ring 8mil, stop-mask expansion 4mil, vias tented up to drill 0.3mm, thermal gap 10mil

### Footprints (pad centres in the part's own frame; a part is rotated, then mirrored left to right if it is on the bottom)
C0805 = smd 1.3 x 1.5: 1 -0.95,0; 2 0.95,0
C1206 = smd 1.6 x 1.8: 1 -1.4,0; 2 1.4,0
SMC_C = smd 2.4 x 2.4: + -2.5,0; - 2.5,0
SOD-123_MINI-SMA = smd 1.5 x 2.1: A 1.8,0; C -1.8,0
2,8-PAD = drill 2.8 pad 5.334: B2,8 0,0
SOT223 = smd 1.5 x 2: 1 -2.3,-3.15; 2 0,-3.15; 3 2.3,-3.15 | smd 3.8 x 2: 4 0,3.15
SO08 = smd 0.61 x 2.21: 1 -1.905,-2.616; 2 -0.635,-2.616; 3 0.635,-2.616; 4 1.905,-2.616; 5 1.905,2.616; 6 0.635,2.616; 7 -0.635,2.616; 8 -1.905,2.616
1X03/90 = drill 1.016 long: 1 -2.54,-3.81; 2 0,-3.81; 3 2.54,-3.81
1X05/90 = drill 1.016 long: 1 -5.08,-3.81; 2 -2.54,-3.81; 3 0,-3.81; 4 2.54,-3.81; 5 5.08,-3.81
1X02 = drill 1.016 long: 1 -1.27,0; 2 1.27,0
1X03 = drill 1.016 long: 1 -2.54,0; 2 0,0; 3 2.54,0
R0805 = smd 1.3 x 1.5: 1 -0.95,0; 2 0.95,0
SM-B5 = smd 2 x 1.7: 1 -2,0; 2 2,0
R0603 = smd 1 x 1.1: 1 -0.85,0; 2 0.85,0
SM-L15B = smd 1.1 x 1.5: 1 -2.4,-1.25; 2 2.4,1.25
CHIPLED_1206 = smd 1.5 x 1.5: A 0,-1.75; C 0,1.75
3.4X2.7-4-PAD = smd 1.4 x 1.15: 1 -1.1,-0.8; 2 1.1,-0.8; 3 1.1,0.8; 4 -1.1,0.8
SOT23 = smd 0.8 x 0.9: 1 -0.95,-1; 2 0.95,-1; 3 0,1
3223W = smd 0.9 x 1.6: 1 -1.4,-1.215; 3 1.4,-1.215 | smd 1.3 x 1.3: 2 0,1.215
B3F-31XX = drill 1.016 octagon: 1 -2.261,-1.245; 2 2.261,-1.245 | drill 1.499 pad 2.159: 3 -3.505,1.245; 4 3.505,1.245
SOT89-BCE = smd 0.8 x 1.4: D 1.499,-1.981; G -1.499,-1.981 | smd 0.8 x 1.9: S 0,-1.727
B1,27 = smd 1.27 x 1.27: TP 0,0
LQFP100 = smd 0.3 x 1.2: 1 -6,-7.75; 2 -5.5,-7.75; 3 -5,-7.75; 4 -4.5,-7.75; 5 -4,-7.75; 6 -3.5,-7.75; 7 -3,-7.75; 8 -2.5,-7.75; 9 -2,-7.75; 10 -1.5,-7.75; 11 -1,-7.75; 12 -0.5,-7.75; 13 0,-7.75; 14 0.5,-7.75; 15 1,-7.75; 16 1.5,-7.75; 17 2,-7.75; 18 2.5,-7.75; 19 3,-7.75; 20 3.5,-7.75; 21 4,-7.75; 22 4.5,-7.75; 23 5,-7.75; 24 5.5,-7.75; 25 6,-7.75; 51 6,7.75; 52 5.5,7.75; 53 5,7.75; 54 4.5,7.75; 55 4,7.75; 56 3.5,7.75; 57 3,7.75; 58 2.5,7.75; 59 2,7.75; 60 1.5,7.75; 61 1,7.75; 62 0.5,7.75; 63 0,7.75; 64 -0.5,7.75; 65 -1,7.75; 66 -1.5,7.75; 67 -2,7.75; 68 -2.5,7.75; 69 -3,7.75; 70 -3.5,7.75; 71 -4,7.75; 72 -4.5,7.75; 73 -5,7.75; 74 -5.5,7.75; 75 -6,7.75 | smd 1.2 x 0.3: 26 7.75,-6; 27 7.75,-5.5; 28 7.75,-5; 29 7.75,-4.5; 30 7.75,-4; 31 7.75,-3.5; 32 7.75,-3; 33 7.75,-2.5; 34 7.75,-2; 35 7.75,-1.5; 36 7.75,-1; 37 7.75,-0.5; 38 7.75,0; 39 7.75,0.5; 40 7.75,1; 41 7.75,1.5; 42 7.75,2; 43 7.75,2.5; 44 7.75,3; 45 7.75,3.5; 46 7.75,4; 47 7.75,4.5; 48 7.75,5; 49 7.75,5.5; 50 7.75,6; 76 -7.75,6; 77 -7.75,5.5; 78 -7.75,5; 79 -7.75,4.5; 80 -7.75,4; 81 -7.75,3.5; 82 -7.75,3; 83 -7.75,2.5; 84 -7.75,2; 85 -7.75,1.5; 86 -7.75,1; 87 -7.75,0.5; 88 -7.75,0; 89 -7.75,-0.5; 90 -7.75,-1; 91 -7.75,-1.5; 92 -7.75,-2; 93 -7.75,-2.5; 94 -7.75,-3; 95 -7.75,-3.5; 96 -7.75,-4; 97 -7.75,-4.5; 98 -7.75,-5; 99 -7.75,-5.5; 100 -7.75,-6
SO16 = smd 0.66 x 2.032: 1 -4.445,-3.073; 2 -3.175,-3.073; 3 -1.905,-3.073; 4 -0.635,-3.073; 5 0.635,-3.073; 6 1.905,-3.073; 7 3.175,-3.073; 8 4.445,-3.073; 9 4.445,3.073; 10 3.175,3.073; 11 1.905,3.073; 12 0.635,3.073; 13 -0.635,3.073; 14 -1.905,3.073; 15 -3.175,3.073; 16 -4.445,3.073
MICROSD-PUSH-OUT = smd 0.7 x 1.6: 1 2.25,11; 2 1.15,11; 3 0.05,11; 4 -1.05,11; 5 -2.15,11; 6 -3.25,11; 7 -4.35,11; 8 -5.45,11 | smd 1.2 x 1.8: G1 -7.75,9.7 | smd 1.2 x 2.2: G2 -7.75,0.4; G4 7.75,0.4 | smd 1.6 x 1.5: G3 6.85,9.95 | hole 1: -4.95,0; 3.05,0
QFN50P400X400X90-20N = smd 0.84 x 0.26: 1 -1.935,1; 2 -1.935,0.5; 3 -1.935,0; 4 -1.935,-0.5; 5 -1.935,-1; 11 1.935,-1; 12 1.935,-0.5; 13 1.935,0; 14 1.935,0.5; 15 1.935,1 | smd 0.26 x 0.84: 6 -1,-1.935; 7 -0.5,-1.935; 8 0,-1.935; 9 0.5,-1.935; 10 1,-1.935; 16 1,1.935; 17 0.5,1.935; 18 0,1.935; 19 -0.5,1.935; 20 -1,1.935 | smd 2.6 x 2.6: 21 0,0
SOP65P490X110-8N = smd 1.25 x 0.46: 1 -2.11,0.975; 2 -2.11,0.325; 3 -2.11,-0.325; 4 -2.11,-0.975; 5 2.11,-0.975; 6 2.11,-0.325; 7 2.11,0.325; 8 2.11,0.975 | smd 1.778 x 2.413: BASE 0,0
LGA14 = smd 1.15 x 0.55: P$1 -1.1,2; P$2 -1.1,1.2; P$3 -1.1,0.4; P$4 -1.1,-0.4; P$5 -1.1,-1.2; P$6 -1.1,-2; P$8 1.1,-2; P$9 1.1,-1.2; P$10 1.1,-0.4; P$11 1.1,0.4; P$12 1.1,1.2; P$13 1.1,2 | smd 0.55 x 1.15: P$7 0,-2.1; P$14 0,2.1
1206 = smd 1.6 x 1.8: 1 -1.4,0; 2 1.4,0
J502-ND-142-0701-871/876 = smd 5.08 x 2.286: 1 2.565,0; G@1 2.565,4.42; G@2 2.565,-4.42 | smd 5.08 x 2.286 bottom: G@3 2.565,4.42; G@4 2.565,-4.42
ASE = smd 0.9 x 1.1: 1 -1.2,-0.75; 2 1.2,-0.75; 3 1.2,0.75; 4 -1.2,0.75
52745-0890 = smd 0.3 x 0.8: 1 -1.75,2.5; 2 -1.25,2.5; 3 -0.75,2.5; 4 -0.25,2.5; 5 0.25,2.5; 6 0.75,2.5; 7 1.25,2.5; 8 1.75,2.5

### Placement (x,y rotation side)
C0  28.57,74.93 180 top
C2  28.89,28.26 270 top
C4  26.99,28.26 270 top
C5  36.51,49.53 90 top
C6  18.73,57.78 270 top
C7  32.38,33.66 0 top
C8  15.24,104.14 0 top
C9  18.73,93.03 270 top
C10  9.84,50.16 90 bottom
C12  17.78,29.53 90 top
C13  24.45,68.9 270 top
C14  37.15,37.47 0 top
C15  22.86,62.23 0 top
C16  16.51,57.78 90 top
C18  34.29,50.48 90 top
C19  3.81,20.64 180 top
C20  7.62,8.89 90 top
C21  10.16,12.7 90 top
C22  10.16,7.62 270 top
C23  18.41,9.53 0 top
C24  9.84,29.84 180 top
C25  26.67,69.22 270 top
C26  23.18,21.27 270 top
C27  32.38,84.77 180 top
C28  18.41,6.99 180 top
C29  25.08,9.21 180 top
C30  30.8,21.59 90 top
C31  24.77,3.49 180 top
C32  33.66,6.99 270 top
C33  4.13,81.92 90 top
C34  38.73,69.53 90 top
C35  35.24,85.72 90 top
C37  29.84,85.72 270 top
C38  35.24,93.03 270 top
C39  38.1,98.11 0 top
C40  38.1,100.01 180 top
C41  27.94,85.72 270 top
C42  38.1,102.23 0 top
C43  32.7,102.23 0 top
C45  28.26,82.87 180 top
C46  29.53,103.5 90 top
C47  29.53,97.79 270 top
C48  27.62,97.79 90 top
C_ACG  38.73,106.05 270 top
CC1  35.24,77.79 90 top
CC2  33.02,111.44 180 top
CC3  35.24,104.46 90 top
CM  28.57,78.74 180 top
CM1  28.57,80.64 180 top
CM2  30.16,113.03 90 top
CM3  36.83,113.98 0 top
CR1  31.43,75.88 90 top
CR2  35.24,74.3 90 top
D1  15.24,107.95 0 top
H1  38,4 0 top
H2  3.68,108.02 0 top
H3  20,73 0 top
H4  4,4 0 top
IC1  15.24,97.47 180 top
IC2  13.97,88.27 180 top
IC3  5.71,15.24 0 top
JP2  17.46,110.81 180 bottom
JP3  5.08,63.18 90 top
JP4  26.35,6.35 180 top
JP5  11.43,3.17 0 top
JP6  23.81,59.69 0 top
JP7  20.95,42.23 270 top
JP8  39.69,47.31 90 top
L0  28.57,76.83 0 top
L1  22.86,27.94 0 top
L2  33.02,29.21 180 top
L3  33.34,87.63 270 top
L4  35.24,97.16 90 top
L5  30.8,5.71 270 top
L6  35.24,100.97 90 top
L7  32.07,97.79 90 top
LCHOKE  28.57,73.03 180 top
LED1  9.53,116.84 90 top
LED2  3.49,116.84 90 top
LM1  31.43,79.69 90 top
LM2  33.34,81.6 90 top
LM3  33.02,113.98 0 top
LR1  32.38,73.34 0 top
LR2  33.34,75.88 90 top
OS1  22.23,32.07 0 top
Q1  37.47,63.82 90 top
R1  19.68,37.47 0 bottom
R2  25.61,31.97 90 top
R3  13.34,111.44 180 top
R4  17.14,111.44 180 top
R7  1.91,15.24 90 top
R8  5.08,8.89 90 top
R9  15.24,12.7 270 top
R10  12.7,12.7 90 top
R11  13.34,9.53 0 top
R12  17.78,12.7 90 top
R13  27.94,24.45 180 top
R14  31.43,24.77 180 top
R15  16.51,4.45 0 top
R16  13.34,6.99 180 top
R17  7.62,113.67 90 top
R18  1.59,113.67 90 top
R19  25.08,21.27 90 top
R20  20.32,14.92 270 top
R21  13.65,34.61 270 top
R22  9.84,38.1 180 top
R23  33.66,14.92 270 top
R24  27.94,20.32 180 top
R25  27.94,22.54 180 top
R26  30.48,88.58 180 top
R27  26.99,89.85 180 top
R28  23.5,90.81 90 top
R29  24.77,86.36 180 top
S1  2.22,81.92 90 bottom
T3  31.43,92.08 90 top
TP1  33.97,42.55 0 top
TP2  33.97,44.77 0 top
U1  23.81,42.86 0 top
U3  26.99,14.92 0 top
U4  1.91,47.62 270 top
U5  30.8,69.22 270 top
U6  36.2,109.22 90 top
U$1  10.79,33.97 0 top
U$2  10.16,113.03 270 bottom
X2  33.71,120 270 top
X3  35.56,69.53 180 top
X4  33.66,60.01 0 top

### Tracks (layer width: path | path; a pad name or v marks a point on that pad's centre or on a via)
32M
  Top 0.254: X3.3 34.29,68.72 U5.17
+3V3  (via drill 0.2, 0.3)
  Top 0.254: IC3.7 5.08,20.51 C19.1 v6.67,20.64 6.67,23.5 10.79,27.62 C24.1 | R15.2 17.46,5.39 17.46,5.4 17.14,5.71 15.88,5.71 v15.56,6.03 | R9.1 15.24,14.61 v15.56,14.92 | 27.94,70.17 C25.1 24.58,70.17 C13.1 24.45,71.44 v24.77,71.75 v26.35,71.75 | U5.8 28.26,69.22 27.94,69.53 27.94,70.17 | X3.4 36.96,68.58 37.47,68.58 | 37.47,68.58 C34.1 | LCHOKE.2 27.62,71.12 27.94,70.8 27.94,70.17 | U5.6 27.99,70.22 27.94,70.17 | C24.1 U$1.P$7 10.7,31.97 U$1.P$6 8.98,31.97 8.57,32.38 8.57,37.78 R22.2 | U$1.P$1 9.7,36.34 9.21,36.83 9.21,37.78 R22.2 | L1.1 20.67,28.13 C12.1 13.46,28.13 11.75,29.84 | 35.65,37.36 U1.27 29.21,37.36 | 35.65,37.36 C14.1 35.75,38.92 39.69,42.86 JP8.1 | U4.4 11.97,48.67 v11.43,49.21 8.89,46.67 R22.2 | v16.51,54.93 C16.1 16.51,57.47 16.83,57.78 21.27,57.78 JP6.1 21.27,62.04 C15.1 21.59,62.36 21.59,63.18 21.91,63.5 | U1.75 16.7,50.61 v16.51,50.8 | LED2.A 5.24,117.95 5.4,118.11 11.11,118.11 11.43,117.79 11.43,117 | 11.43,117 LED1.A | 37.47,68.58 v37.47,67.63 33.34,63.5 32.07,63.5 | 11.75,29.84 13.65,31.75 R21.2 15.24,33.66 | 11.75,29.84 C24.1 | U1.100 16.06,34.48 15.24,33.66 | 19.37,32.38 19.85,32.87 OS1.4 20.95,33.04 20.95,33.66 20.31,34.3 U1.6 20.32,36.51 21.17,37.36 22.86,37.36 | 19.37,32.38 18.41,32.38 17.78,33.02 15.88,33.02 15.24,33.66 | 35.65,37.36 35.65,29.84 L2.1 | R2.1 25.61,30.06 25.4,29.84 20.32,29.84 19.37,30.8 19.37,32.38 | 29.21,37.36 22.86,37.36 | 29.21,37.36 29.21,48.58 29.5,48.86 U1.50 34.07,48.86 C18.1 | X4.2 32.41,63.16 32.07,63.5 | U1.11 22.81,37.31 22.86,37.36 | 21.91,63.5 16.51,63.5 11.75,68.26 JP3.5 | 11.43,117 11.43,114.62 9.84,113.03 9.84,86.68 11.43,85.09 13.95,85.09 IC2.4 13.99,85.09 19.37,85.09 20,85.72 20,89.22 22.54,91.75 R28.2 v23.5,93.34
  Top 0.254: 21.91,63.5 25.4,63.5 26.04,62.87 30.8,62.87 31.43,63.5 32.07,63.5 | U6.6 36.52,110.5 36.51,110.4 25.63,110.4 v23.5,108.27
  Top 0.5: IC2.4 13.97,80.64 8.89,75.56 JP3.5
  Bottom 0.254: v15.56,6.03 v15.56,14.92 12.38,14.92 v6.67,20.64 | C10.1 10.98,48.77 v11.43,49.21 13.02,50.8 v16.51,50.8 v16.51,54.93 | v24.77,71.75 28.26,71.75 32.38,67.63 v37.47,67.63 | v23.5,108.27 v23.5,93.34
+5V
  Top 0.5: C9.1 18.63,94.32 IC1.4 12.41,94.32 11.75,93.66 11.75,91.49 IC2.3
+BATT  (via drill 0.3)
  Top 0.5: L5.1 31.02,7.93 C32.1 v33.66,11.43 | R3.2 11.43,111.44 11.11,111.12 v11.11,109.86 11.11,108.27 11.43,107.95 D1.C 13.44,104.84 C8.+ 12.74,102.23 | 12.74,102.23 12.74,101.92 | 12.74,101.92 12.74,100.82 IC1.3 | 29.53,100.19 C47.1 C48.2 | 29.53,100.19 L7.2 | 12.74,101.92 12.93,102.11 C46.1 29.53,100.19 | v11.11,102.23 12.74,102.23 | v33.66,24.77 R14.1
  Bottom 0.5: v11.11,109.86 10.48,109.86 10.16,110.17 U$2.2 | v33.66,11.43 v33.66,24.77 33.66,32.07 37.47,35.88 37.47,64.14 39.69,66.36 39.69,71.75 37.47,73.98 24.77,73.98 21.27,77.47 15.24,77.47 11.11,81.6 v11.11,102.23
ADC1_0  (via drill 0.2)
  Top 0.254: R7.2 6.03,16.19 6.35,16.51 IC3.6 6.35,19.05 v8.26,20.95 | U1.22 28.31,33.92 v28.89,33.34
  Bottom 0.254: v8.26,20.95 13.34,26.04 21.59,26.04 v28.89,33.34
ADC2_3  (via drill 0.2)
  Top 0.254: R3.1 15.24,111.44 | 15.24,111.44 R4.2 | 31.43,33.34 C7.1 | 31.43,33.34 30.48,33.34 29.81,34.01 U1.25 | 31.43,33.34 31.43,35.24 30.16,36.51 v27.62,36.51 | v15.24,109.86 15.24,111.44 | v15.56,83.19 v15.56,71.12
  Bottom 0.254: v27.62,36.51 27.62,43.5 22.54,48.58 22.54,64.14 v15.56,71.12 | v15.24,109.86 15.56,109.54 v15.56,83.19
BLIGHT_CTRL
  Top 0.254: Q1.1 39.37,62.87 39.69,62.55 39.69,59.37 33.97,53.66 26.67,53.66 25.81,52.8 U1.59
BOOT0  (via drill 0.2)
  Top 0.254: U1.94 16.97,39.86 17.14,39.69 17.14,37.78 v17.46,37.47
  Bottom 0.254: v17.46,37.47 R1.2
DAC_OUT  (via drill 0.2)
  Top 0.254: U1.28 30.72,37.86 v30.16,38.42 | C26.1 v23.18,24.13
  Bottom 0.254: v23.18,24.13 23.18,25.4 30.16,32.38 v30.16,38.42
GND  (via drill 0.2, 0.3)
  Top 0.254: U6.7 35.87,112.39 35.88,112.39 37.47,112.39 37.78,112.71 CM3.2 | U6.2 35.87,107.94 35.88,108.06 v33.97,108.06 | v30.16,68.58 U5.21 | U5.18 31.75,69.22 31.75,69.53 v31.43,69.85 | CR1.2 v31.43,76.95 | U$1.P$2 10.79,35.17 | 10.79,35.17 U$1.P$12 | v10.79,34.41 10.79,35.17 | U1.10 22.31,36.22 v21.91,36.63 | U1.99 15.02,37.36 v14.61,36.95 | U1.49 30.47,48.36 v30.16,48.06 | U1.74 18.31,49.11 v18.41,49.01 | U1.19 26.81,36.17 v26.35,36.63
  Top 2.75: 29.53,92.08 31.43,92.08
  other vias: 31.43,83.3 31.43,82.03 10.79,33.45 23.5,31.23 13.34,41.07 18.73,39.17 35.24,53.45 31.43,61.6 8.57,12.81 8.57,11.86 11.43,51.23 11.43,50.28 27.3,118.54 27.3,117.59 27.3,116.64 27.3,115.69 27.3,114.73 27.94,114.1 31.11,118.54 31.11,117.59 31.11,116.64 31.11,115.69 36.2,118.54 36.2,117.59 36.2,116.64 36.2,115.69 40.01,118.54 40.01,117.59 40.01,116.64 40.01,115.69 40.01,114.73 39.37,114.1 14.61,43.3 17.46,42.02 18.1,40.44 23.18,41.07 23.18,38.85 23.18,43.61 20,47.42 21.59,49.33 25.72,43.3 25.72,41.07 25.72,38.85 27.94,45.52 26.35,47.42 24.77,49.01 27.62,49.01 30.16,45.52 30.16,42.98 30.16,40.76 16.83,35.36 16.83,34.41 10.79,46.79 10.16,45.84 10.16,42.98 12.06,42.98 6.03,42.66 5.71,39.8 2.54,42.02 2.54,49.96 32.07,92.51 31.11,92.51 30.16,92.51 29.21,92.51 29.21,91.56 30.16,91.56 31.11,91.56 32.07,91.56 32.07,90.6 31.11,90.6 30.16,90.6 28.26,92.51 28.26,91.56 30.16,93.46 31.11,93.46 32.07,93.46 34.92,90.6 36.51,90.6 36.83,92.19 36.83,93.78 36.83,95.36 36.83,96.64 38.1,96.64 39.37,96.64 32.7,100.76 33.97,100.76 33.97,99.49 33.97,97.91 33.97,96.64 30.16,95.36 31.75,94.73 30.8,94.73 28.89,95.36 27.62,95.36 26.35,95.36 26.04,96.64 26.04,97.91 26.04,99.17 26.35,100.13 27.3,100.13 28.26,100.13 27.94,101.08 26.99,101.08 26.04,101.08 27.94,103.3 26.99,103.3 26.04,103.3 27.94,104.57 27.94,106.48 29.21,106.48 30.48,106.48 31.75,106.48 31.43,104.25 33.02,104.25 33.02,106.48 33.97,107.11 33.97,109.02 33.02,109.33 31.75,109.33 30.48,109.33 29.21,109.33 27.94,109.33 26.67,109.33 26.67,111.24 26.67,112.19 26.67,113.14 26.67,114.1 28.26,112.19 38.1,112.51 39.69,112.83 38.42,110.29 39.37,109.33 38.42,108.7 31.75,108.06 28.26,107.75 25.72,107.43 24.77,105.21 36.83,103.94 39.05,103.62 19.37,101.08 19.37,100.13 19.37,99.17 18.1,98.54 16.83,98.54 18.73,106.8 18.73,108.06 18.73,109.33 19.68,105.53 19.68,104.25 19.68,102.98 2.54,36.95 5.71,35.36 2.86,32.82 6.03,30.91 2.54,28.69 5.4,26.47 2.22,23.93 9.21,28.05 13.65,29.96 15.56,31.86 15.88,29.64 15.24,35.04 15.24,35.99 25.4,36.63 32.07,35.99 33.97,36.31 33.34,35.36 34.61,35.04 34.29,38.53 35.24,39.8 38.42,42.98 40.01,51.87 39.05,51.87 38.42,52.82 39.69,55.04 39.37,56.95 32.07,52.5 31.11,51.23 31.75,49.96 20.95,56.63 14.61,58.85 14.61,62.03 11.75,62.66 11.43,57.58 8.89,55.99 6.67,55.36 6.67,49.65 1.59,56.95 3.17,56.95 2.22,59.49 2.54,61.71 1.91,64.25 2.86,66.79 1.91,69.33 2.86,72.82 1.59,75.05 4.13,76.31 2.54,83.3 2.54,81.71 1.59,86.16 7.62,76.63 9.53,78.54 9.84,80.76 9.53,84.25 7.62,87.75 3.81,89.97 1.91,93.14 3.81,96.32 2.22,99.49 3.49,102.35 1.59,104.57 7.94,103.62 13.02,97.59 14.29,97.59 16.83,97.59 18.1,97.59 10.79,103.62 10.79,105.21 10.79,106.8 11.75,106.16 14.61,106.16 14.61,103.62 16.83,106.16 17.78,106.16 12.38,109.97 13.65,109.97 11.75,113.14 13.34,113.14 8.57,106.8 8.57,110.29 5.4,114.1 3.49,118.54 13.02,116 18.73,116.32 19.37,116.95 20.64,116.95 21.27,116.32 21.59,115.69 21.59,114.73 21.59,113.78 18.73,113.14 21.27,113.14 20.64,112.51 19.37,112.51 21.59,110.92 15.88,117.91 23.81,116.95 24.13,114.1 23.5,111.56 21.59,108.06 21.91,105.53 21.59,103.62 21.91,100.76 20.95,98.22 21.91,96 20.64,93.78 7.3,97.59 8.89,93.46 18.73,89.33 12.38,88.38 13.65,88.38 14.61,88.38 16.51,88.38 18.41,86.79 20.95,89.02 18.41,84.25 27.3,91.56 26.35,91.56 26.67,93.78 28.26,93.78 26.67,92.83 38.42,94.09 38.42,89.65 34.92,89.65 34.92,88.7 35.88,88.38 36.51,87.75 36.51,86.79 36.51,85.84 36.51,84.89 36.51,83.94 35.88,83.3 34.92,83.3 38.42,86.16 34.92,82.35 34.92,81.39 36.51,80.12 33.34,78.86 36.83,79.17 36.83,78.22 36.83,77.27 36.83,76.31 36.83,75.36 36.83,72.82 36.2,71.87 37.78,71.87 26.35,72.82 26.35,75.05 26.35,76 26.35,76.95 26.35,77.9 26.35,78.86 26.35,79.81 26.35,80.76 25.72,81.39 25.08,82.03 25.08,82.98 25.08,83.94 24.13,83.94 23.18,84.25 23.18,85.2 23.18,86.16 24.77,86.79 24.77,87.75 24.77,88.7 31.43,87.11 31.75,86.47 27.62,88.06 28.26,82.98 21.91,82.03 24.13,78.86 18.73,80.44 13.02,76.63 14.61,79.81 13.02,81.39 13.02,83.3 10.79,73.78 13.65,71.23 10.48,69.97 16.83,75.68 14.92,68.69 18.1,66.16 27.3,66.79 27.62,65.84 26.67,65.2 26.04,64.57 25.08,64.57 24.13,64.57 23.18,64.57 22.54,65.84 22.23,68.38 20.32,69.01 16.83,71.55 24.13,73.14 26.35,66.79 25.4,66.16 24.45,66.16 23.5,66.16 22.86,67.42 22.86,66.47 22.86,69.33 22.86,70.28 23.5,71.87 25.4,72.82 11.43,66.47 13.97,64.57 18.1,62.03 25.08,56.95 26.67,56.95 24.13,55.04 31.11,55.99 31.11,58.53 33.34,65.2 35.24,66.79 40.01,64.25 40.01,65.2 40.01,63.3 40.01,41.71 39.05,40.12 40.32,38.85 40.32,37.9 40.32,36.95 40.01,35.99 39.05,35.99 38.42,35.36 30.48,31.55 32.07,31.86 34.61,31.23 37.15,33.77 36.83,31.86 36.83,29.64 39.37,33.13 36.83,28.05 34.92,27.1 32.07,26.79 25.08,24.56 30.48,26.79 27.62,25.83 34.92,24.56 32.38,22.98 32.38,20.75 32.38,17.89 39.69,27.1 36.2,22.34 39.37,19.48 36.2,15.67 39.37,11.86 20,23.93 14.29,23.93 10.16,20.12 13.34,17.26 19.05,17.58 16.83,19.8 20.95,20.75 15.24,27.1 12.06,27.42 9.21,23.93 22.86,28.69 35.56,8.05 39.69,7.42 33.66,3.61 32.07,9.96 29.21,9.96 32.7,12.5 24.45,14.72 22.86,14.72 27.3,15.04 31.11,15.04 21.91,9.64 21.91,8.69 21.91,7.74 21.91,6.78 21.91,5.83 21.91,4.88 23.18,7.1 23.18,5.83 19.37,5.2 19.05,3.61 21.91,3.92 21.91,2.97 21.91,2.02 24.45,1.7 27.94,2.02 32.38,1.7 29.84,5.83 34.92,1.7 14.29,2.02 17.14,2.34 7.62,9.01 10.16,10.59 19.68,11.54 20.95,11.54 20.95,12.5 19.68,12.5 18.41,15.36 10.16,15.04 8.89,16.31 7.3,15.36 3.81,15.36 1.59,18.21 2.54,18.85 5.4,22.34 1.59,12.81 2.86,10.59 1.59,8.05 7.94,5.51 7.94,2.02 11.43,1.39 12.7,37.26 40.32,82.35 38.73,79.49 40.01,76.63 38.73,75.36 40.32,73.46
  pour Top (isolate 0.254): -0.32,120.52 42.18,120.52 42.5,0 0,0
  pour Bottom (isolate 0.254): -0.32,120.52 42.18,120.52 42.5,0 0,0
I2C1_SCL
  Top 0.254: U$1.P$14 R22.1 11.75,38.1 14.51,40.86 U1.92
I2C1_SDA
  Top 0.254: U1.93 15.28,40.36 13.65,38.73 R21.1 13.24,35.97 U$1.P$13
LED_GRN  (via drill 0.2)
  Top 0.254: U1.81 17.79,46.36 v18.1,46.67 | R18.1 v3.17,112.72 v3.17,112.71
  Bottom 0.254: v18.1,46.67 17.14,46.67 15.24,44.77 6.99,44.77 5.71,46.04 5.71,104.78 6.99,106.05 6.99,110.17 4.45,112.71 v3.17,112.71
LED_RED  (via drill 0.2)
  Top 0.254: U1.82 18.88,45.86 v19.05,46.04 | R17.1 7.62,105.41 6.03,103.82 v4.45,103.82
  Bottom 0.254: v19.05,46.04 17.46,46.04 15.56,44.13 6.67,44.13 5.08,45.72 5.08,103.19 v4.45,103.82
MIC_AMP_IN
  Top 0.254: R16.2 12.38,6.04 12.06,5.71 10.66,5.71 10.57,5.81 | 10.57,5.81 C22.2 | JP5.1 10.16,5.4 10.57,5.81
N$1  (via drill 0.3)
  Top 0.254: C6.2 v18.73,54.93 | U1.73 18.81,52.31 v18.73,52.39
  Bottom 0.254: v18.73,52.39 v18.73,54.93
N$3
  Top 0.254: R20.1 24.13,15.88 25.08,16.83 U3.14 R19.1
N$4
  Top 0.254: R7.1 4.76,14.29 5.08,13.97 IC3.2 R8.2
N$5
  Top 0.254: R10.1 12.7,9.84 R11.1 11.88,9.02 C22.1
N$6
  Top 0.254: U1.48 36.24,47.86 C5.1
N$8
  Bottom 0.5: U$2.1 14.73,114.43 JP2.1
N$9
  Top 0.254: U6.1 35.24,107.09
  Top 0.5: 35.24,107.09 CC3.2
N$10
  Top 0.254: R8.1 7.17,7.94 C20.1
N$11
  Top 0.254: LED1.C 7.78,114.77 R17.2
N$12
  Top 0.254: LED2.C 1.74,114.77 R18.2
N$13
  Top 0.254: R24.1 U3.11 28.89,16.19 29.21,15.88 R23.1
N$14
  Top 0.254: C26.2 23.18,21.27 25.08,21.27 R19.2 25.4,22.54 R25.2
N$15
  Top 0.254: L3.2 C27.1 | C27.1 LM2.2 | C27.1 C35.1
N$16
  Top 0.254: C28.2 R16.1 14.29,4.76 14.61,4.45 R15.1
N$17
  Top 0.254: IC3.3 6.35,13.97 6.67,14.29 8.26,14.29 8.89,13.65 C21.2 R10.2
N$18
  Top 0.254: R12.1 R9.2 14.29,11.75 13.97,11.43 13.97,9.84 R11.2 C23.1
N$19
  Top 0.254: U1.39 33.16,43.36 TP1.TP
N$20
  Top 0.254: U1.40 33.07,43.86 TP2.TP
N$21
  Top 0.254: 33.71,113.61 LM3.2 CM3.1
  Top 0.5: 33.71,113.61 X2.1
N$22
  Top 0.254: CM2.1 30.48,111.76 31.75,111.76 CC2.2
  Top 0.5: LM3.1 CC2.2
N$23
  Top 0.254: L0.1 C0.2
N$24
  Top 0.254: LM1.1 CM.1 L0.2
N$25
  Top 0.254: CM1.1 LM1.2 LM2.1
N$27
  Top 0.178: R25.1 27.94,22.54 27.94,19.37 27.62,19.05 U3.12
  Top 0.254: U3.13 26.35,16.51 26.67,16.19 27.3,16.19 27.62,16.51 U3.12 | R14.2 30.48,24.45 R13.1 R25.1 29.34,22.99 C30.2
N$28
  Top 0.254: R27.2 26.04,87.7 R29.1
N$29
  Top 0.254: LR2.2 CC1.1 CR2.2
N$30
  Top 0.254: T3.G 33.41,88.58 L3.1 R26.1
N$31
  Top 0.254: CC1.2 35.24,80.01 40.32,85.09 40.32,110.49 39.48,111.33 U6.5
N$32
  Top 0.254: CC2.1 34.08,111.33
  Top 0.5: 34.08,111.33 U6.8
N$33
  Top 0.254: U6.4 37.28,107 C_ACG.1
N$34
  Top 0.254: R28.1 23.5,87.7 R29.3
N$35
  Top 0.5: L4.1 35.24,95.25 | 35.24,95.25 C38.1 | L7.1 33.32,93.57 T3.D 33.41,95.25 | 33.41,95.25 33.34,95.25 | 33.41,95.25 35.24,95.25
N$36
  Top 0.254: C39.1 37.05,98 | C40.2 37.05,100.11
  Top 0.5: 37.05,98 L4.2 L6.1 37.05,100.11
N$37
  Top 0.254: C43.2 34.07,101.81 | C42.1 36.73,101.81
  Top 0.5: CC3.1 L6.2 | 34.07,101.81 L6.2 | 36.73,101.81 L6.2
NRST  (via drill 0.2)
  Top 0.254: R2.2 25.51,33.02 24.77,33.02 24.45,33.34 24.45,33.97 24.31,34.11 U1.14 24.31,36.33 v24.13,36.51
  Bottom 0.254: v24.13,36.51 24.13,45.09 17.78,51.44 17.78,57.78 14.92,60.64 JP3.2
OSC_IN
  Top 0.254: OS1.3 23.32,35.1 U1.12
PA_BIAS
  Top 0.254: R26.2 29.53,86.67 C37.1 C41.1 27.62,86.36 26.99,86.36 25.77,85.14 25.72,85.14 | R29.2 25.72,85.14 | C45.2 26.86,84 25.72,85.14
PA_SUPP
  Top 0.5: U3.4 26.35,9.84 26.48,9.71 C29.1 26.35,9.08 26.35,4.13 26.16,3.94 C31.1 26.39,3.71 L5.2
PTT_INT  (via drill 0.2)
  Top 0.254: C33.1 3.17,80.96 1.87,79.65 S1.1 0.95,79.63 0.95,77.79 4.45,74.3 v4.45,38.1 | U1.97 14.87,38.36 v14.61,38.1
  Bottom 0.254: v14.61,38.1 v4.45,38.1
RXN
  Top 0.254: U5.3 30.8,71.75 31.11,72.07 31.11,72.7 LR1.1 CR1.1 LR2.1
RXP
  Top 0.254: U5.2 31.3,71.62 31.75,72.07 32.06,72.07 LR1.2 CR2.1
SD_CLK
  Top 0.254: U1.80 17.14,46.86 17.14,49.21 16.83,49.53 13.97,49.53 13.72,49.77 U4.5
SD_CMD
  Top 0.254: U4.3 12.02,47.58 11.75,47.31 11.75,44.77 12.06,44.45 14.29,44.45 15.2,45.36 U1.83
SD_D0
  Top 0.254: U4.7 11.84,51.98 11.43,52.39 11.43,53.66 11.75,53.98 21.91,53.98 22.81,53.07 U1.65
SD_D1
  Top 0.254: U4.8 21.86,53.08 22.31,52.62 U1.66
SD_D2  (via drill 0.2)
  Top 0.254: U4.1 14.26,45.38 v14.61,45.72 | U1.78 14.69,47.86 v14.61,47.94
  Bottom 0.254: v14.61,47.94 v14.61,45.72
SD_D3
  Top 0.254: U4.2 14.09,46.48 14.98,47.36 U1.79
SPI1_CS  (via drill 0.2)
  Top 0.254: X4.6 34.41,58.85 v34.29,58.74 | U1.32 32.56,39.86 33.02,40.32 v34.29,40.32
  Bottom 0.254: v34.29,40.32 v34.29,58.74
SPI1_MOSI  (via drill 0.2)
  Top 0.254: X4.5 33.91,59.94 v33.66,59.69 | U1.31 33.33,39.36 v33.66,39.69
  Bottom 0.254: v33.66,59.69 v33.66,39.69
SPI1_SCK  (via drill 0.2)
  Top 0.254: X4.4 33.41,61.03 v33.02,60.64 | U1.29 32.97,38.36 v33.02,38.42
  Bottom 0.254: v33.02,38.42 v33.02,60.64
SPI2_CS  (via drill 0.2)
  Top 0.254: U1.55 27.81,51.56 v27.3,52.07 | U5.15 31.8,64.5 31.43,64.14 v26.99,64.14
  Bottom 0.254: v26.99,64.14 27.62,63.5 27.62,53.98 27.3,53.66 v27.3,52.07
SPI2_MISO  (via drill 0.2)
  Top 0.254: U1.53 28.81,52.62 v29.21,53.02 | U5.13 30.8,65.72 30.48,65.41 v28.89,65.41
  Bottom 0.254: v28.89,65.41 29.21,65.09 v29.21,53.02
SPI2_MOSI  (via drill 0.2)
  Top 0.254: U1.54 28.31,52.65 v27.94,53.02 | U5.14 31.3,64.95 31.11,64.77 v27.94,64.77
  Bottom 0.254: v27.94,53.02 27.94,53.34 28.26,53.66 28.26,64.45 v27.94,64.77
SPI2_SCK  (via drill 0.2)
  Top 0.254: U1.52 29.31,51.54 v29.84,52.07 | U5.12 30.3,66.49 v29.84,66.04
  Bottom 0.254: v29.84,52.07 v29.84,66.04
SPK_N
  Top 0.254: R20.2 20.64,13.65 24.45,13.65 25.08,13.02 | 25.08,13.02 U3.3 | R24.2 25.72,19.05 25.72,13.65 25.08,13.02
  Top 0.5: U3.3 JP4.2
SPK_P
  Top 0.254: R23.2 27.94,13.97 27.62,13.65 U3.5
  Top 0.5: U3.5 27.62,10.79 27.94,10.48 27.94,8.26 27.62,7.94 JP4.1
SWCLK  (via drill 0.2)
  Top 0.254: U1.76 14.64,48.86 v14.61,48.9 | v14.61,50.16 v14.61,52.39
  Bottom 0.254: v14.61,48.9 v14.61,50.16 | v14.61,52.39 14.61,56.52 11.75,59.37 7.3,59.37 6.35,60.33 6.35,62.55 6.99,63.18 JP3.3
SWDIO  (via drill 0.2)
  Top 0.254: U1.72 19.31,51.38 v19.68,51.75
  Bottom 0.254: v19.68,51.75 19.68,58.42 14.92,63.18 13.34,63.18 10.79,65.72 JP3.4
TFT_A0  (via drill 0.2)
  Top 0.254: U1.63 23.81,52.39 25.72,54.29 v32.38,54.29 | X4.3 32.91,61.8 v32.38,61.28
  Bottom 0.254: v32.38,54.29 v32.38,61.28
TFT_LED
  Top 0.254: X4.8 36.16,62.51 36.51,62.87 36.51,63.77 Q1.3
TFT_RST
  Top 0.254: U1.64 23.31,52.84 25.4,54.93 33.34,54.93 34.92,56.52 34.92,62.49 X4.7
TRX_NIRQ  (via drill 0.2)
  Top 0.254: U1.35 35.01,41.36 v35.56,41.91 | U5.11 29.18,67.28 v28.57,66.67
  Bottom 0.254: v28.57,66.67 33.66,66.67 35.56,64.77 35.56,54.29 35.88,53.98 35.88,53.02 35.56,52.7 v35.56,41.91
TRX_SDN  (via drill 0.2, 0.3)
  Top 0.254: U5.1 33.05,71.15 v33.66,71.75 | U1.34 35.47,40.86 v35.56,40.96
  Bottom 0.254: v35.56,40.96 36.83,42.23 36.83,65.09 38.73,66.99 38.73,67.94 34.92,71.75 v33.66,71.75
TRX_SW  (via drill 0.2, 0.3)
  Top 0.254: U6.3 36.52,105.72 v36.83,105.41 | U1.5 19.81,34.1 v19.05,33.34 | v7.62,36.51 7.62,55.88 6.67,56.83 6.67,79.38 9.53,82.23 v12.38,82.23
  Bottom 0.254: v36.83,105.41 26.67,105.41 24.77,103.5 24.77,91.44 21.59,88.27 21.59,85.41 19.37,83.19 17.46,83.19 16.51,82.23 v12.38,82.23 | v19.05,33.34 12.06,33.34 11.43,32.7 10.16,32.7 9.53,33.34 9.53,34.61 v7.62,36.51
TX
  Top 0.254: U5.4 30.3,71.62 29.84,72.07 29.84,72.7 LCHOKE.1 C0.1
USART1_RX  (via drill 0.2)
  Top 0.254: JP6.2 23.81,56.2 22.54,54.93 v20.95,54.93 | U1.69 20.81,51.93 v20.95,52.07
  Bottom 0.254: v20.95,54.93 v20.95,52.07
USART2_RX
  Top 0.254: JP7.2 18.73,42.23 17.6,43.36 U1.87
USART2_TX
  Top 0.254: U1.86 17.51,43.86 18.41,44.77 JP7.1
USART3_RX
  Top 0.254: U1.47 33.92,47.36 34.29,46.99 37.78,46.99 38.1,47.31 JP8.2
VDDA
  Top 0.254: U1.21 27.81,31.24 28.89,30.16 C2.1 L2.2
VREF
  Top 0.254: L1.2 24.86,28.99 25.08,29.21 C4.1 27.31,29.53 U1.20

### Text on the board
tDocu: TR_9_MAIN_BOARD_1.2 | TR-9